# EasyEDA Pro project 高低温转接板_自动化测试平台.eprj

# Schematic Schematic1

## Sheets
1 模拟开关
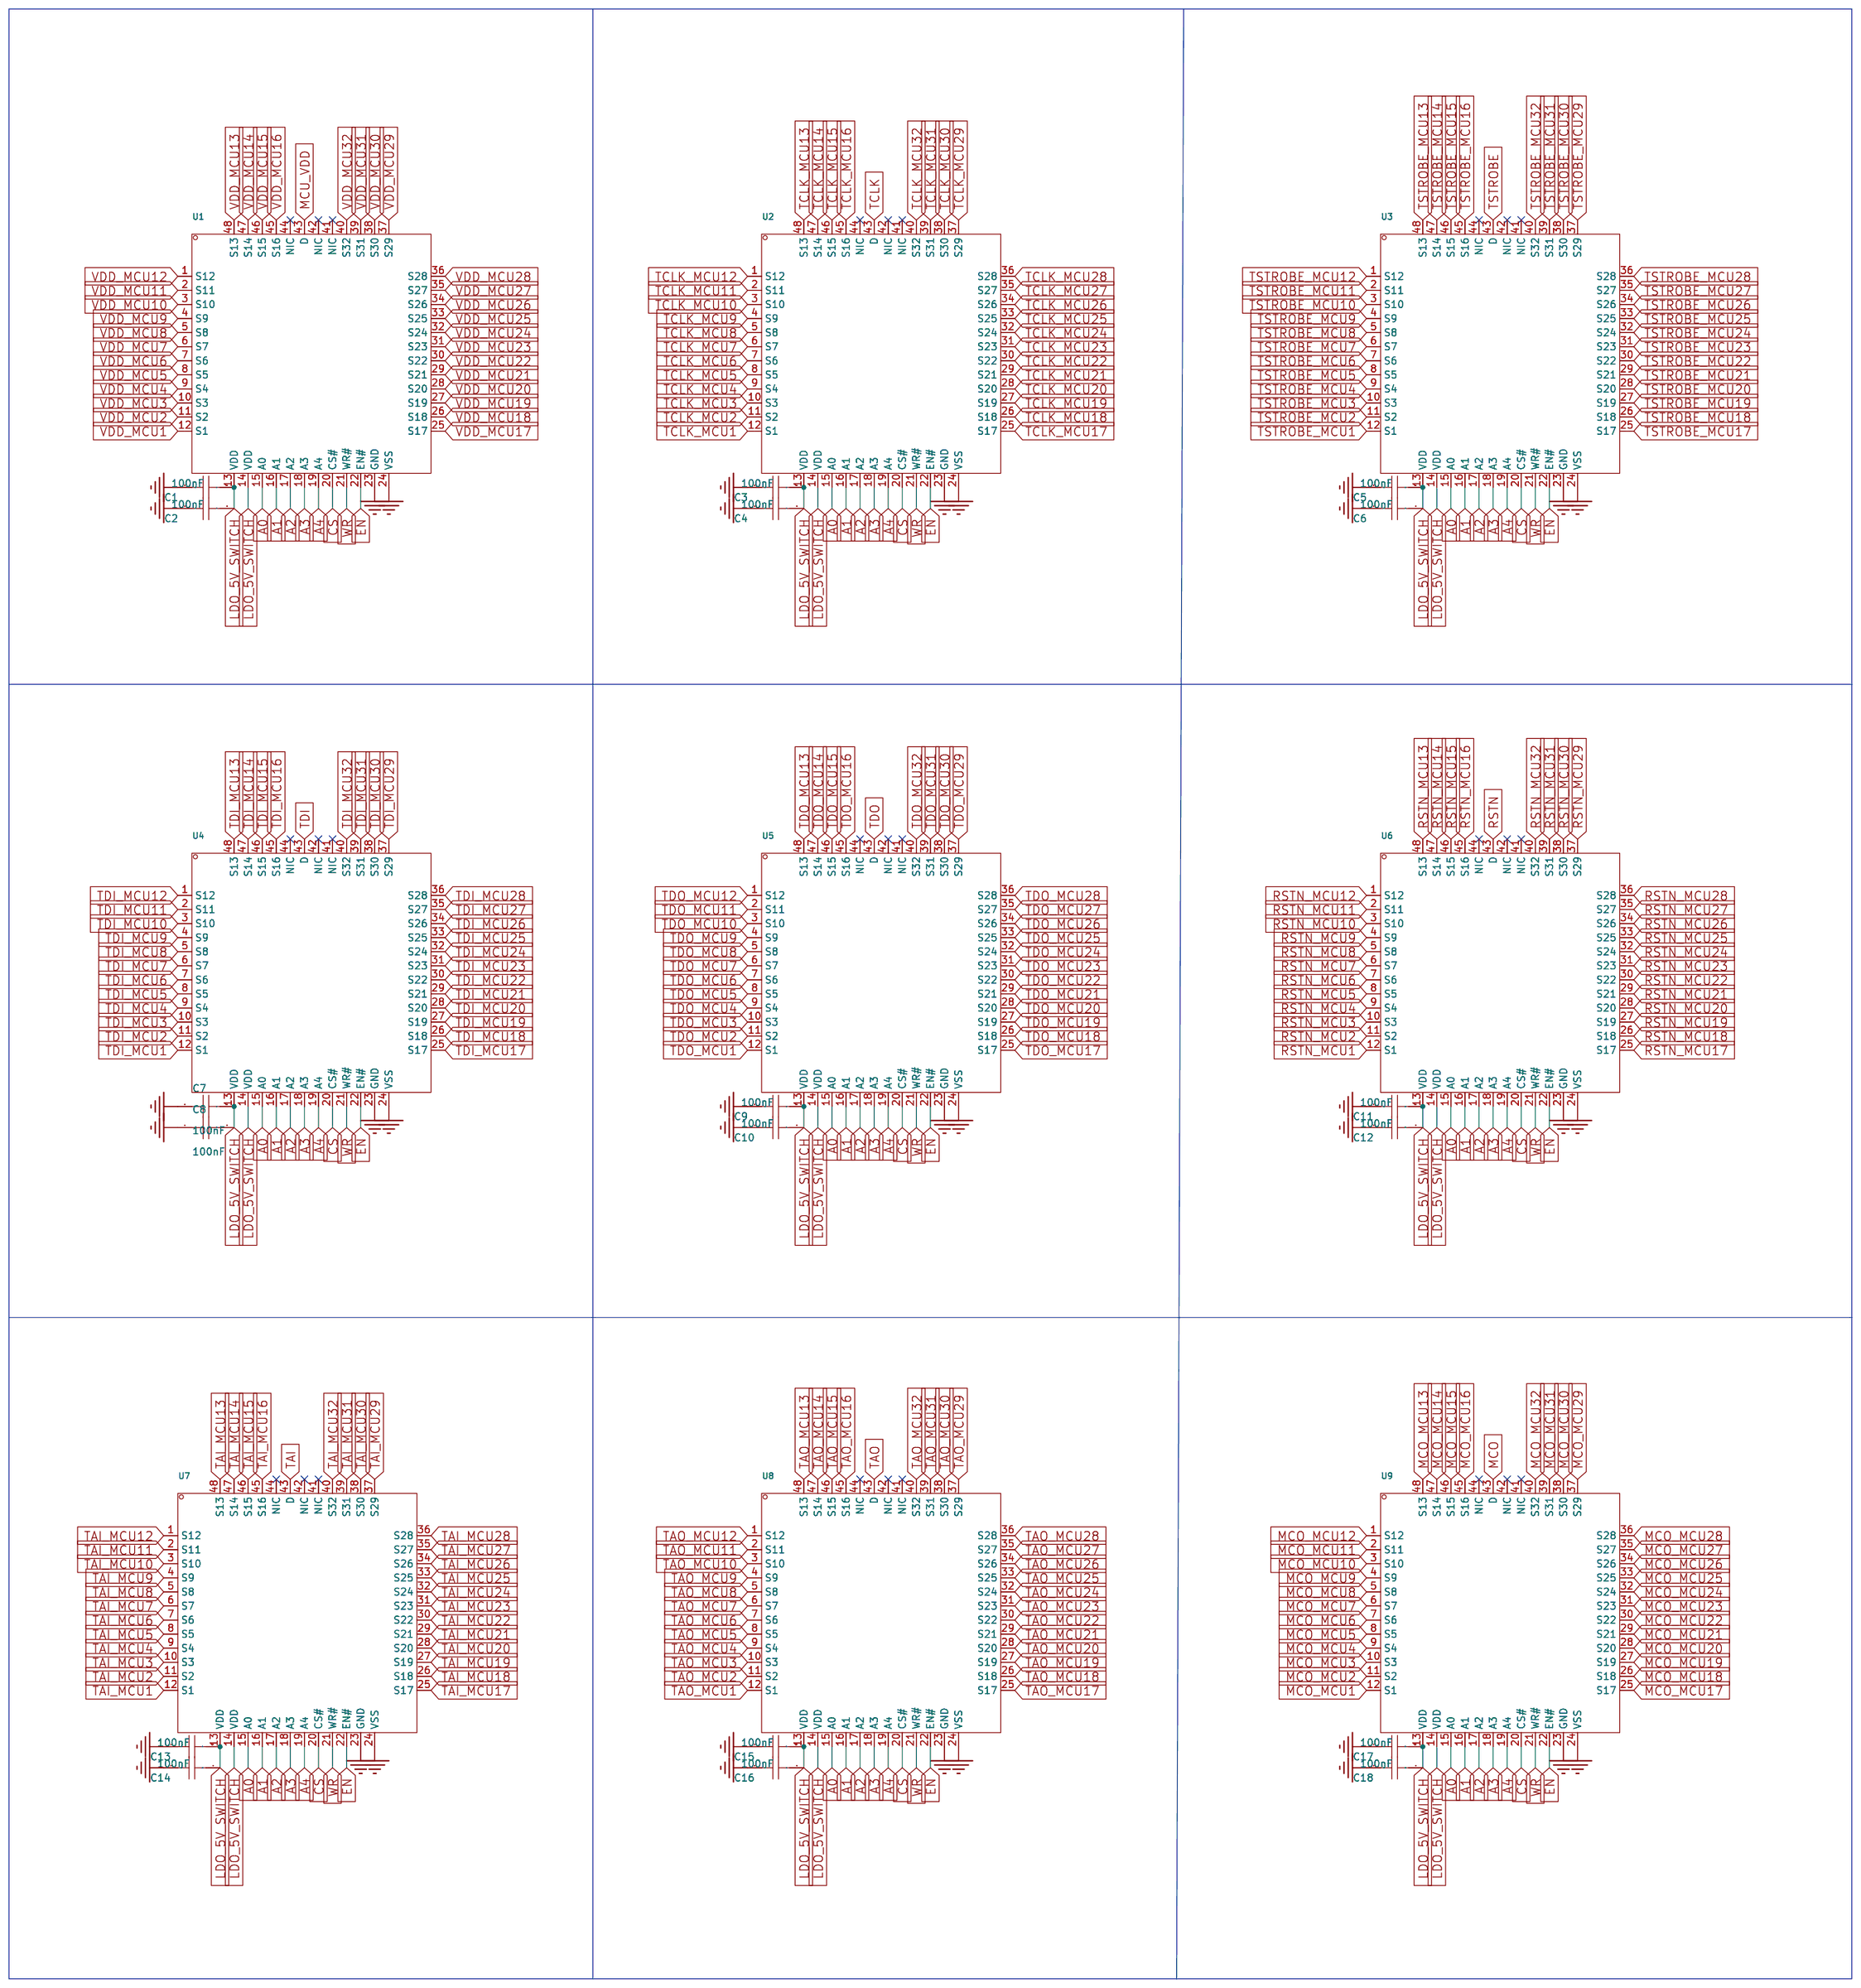
[diagram p0: 模拟开关]
2 485
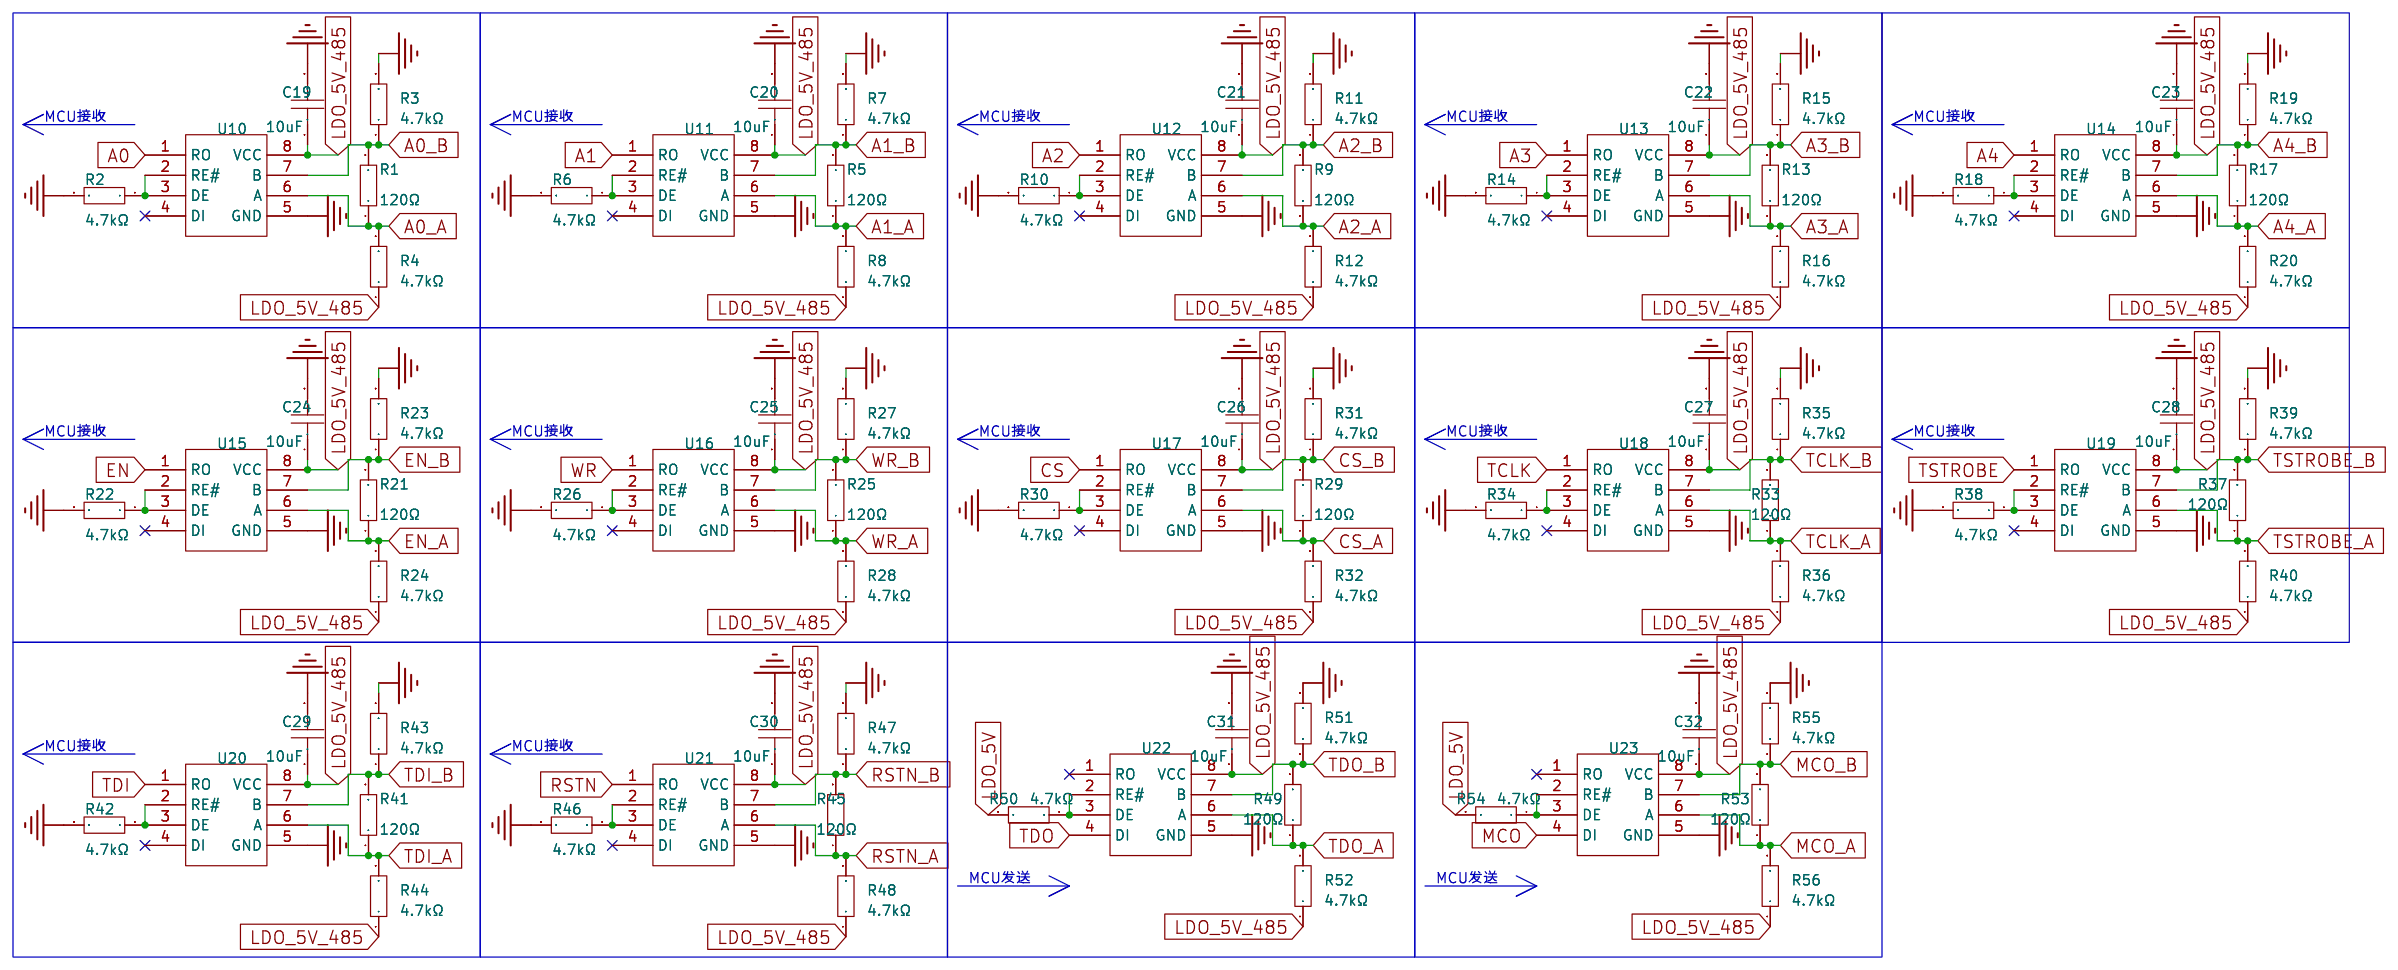
[diagram p1: 485]
3 NI接口
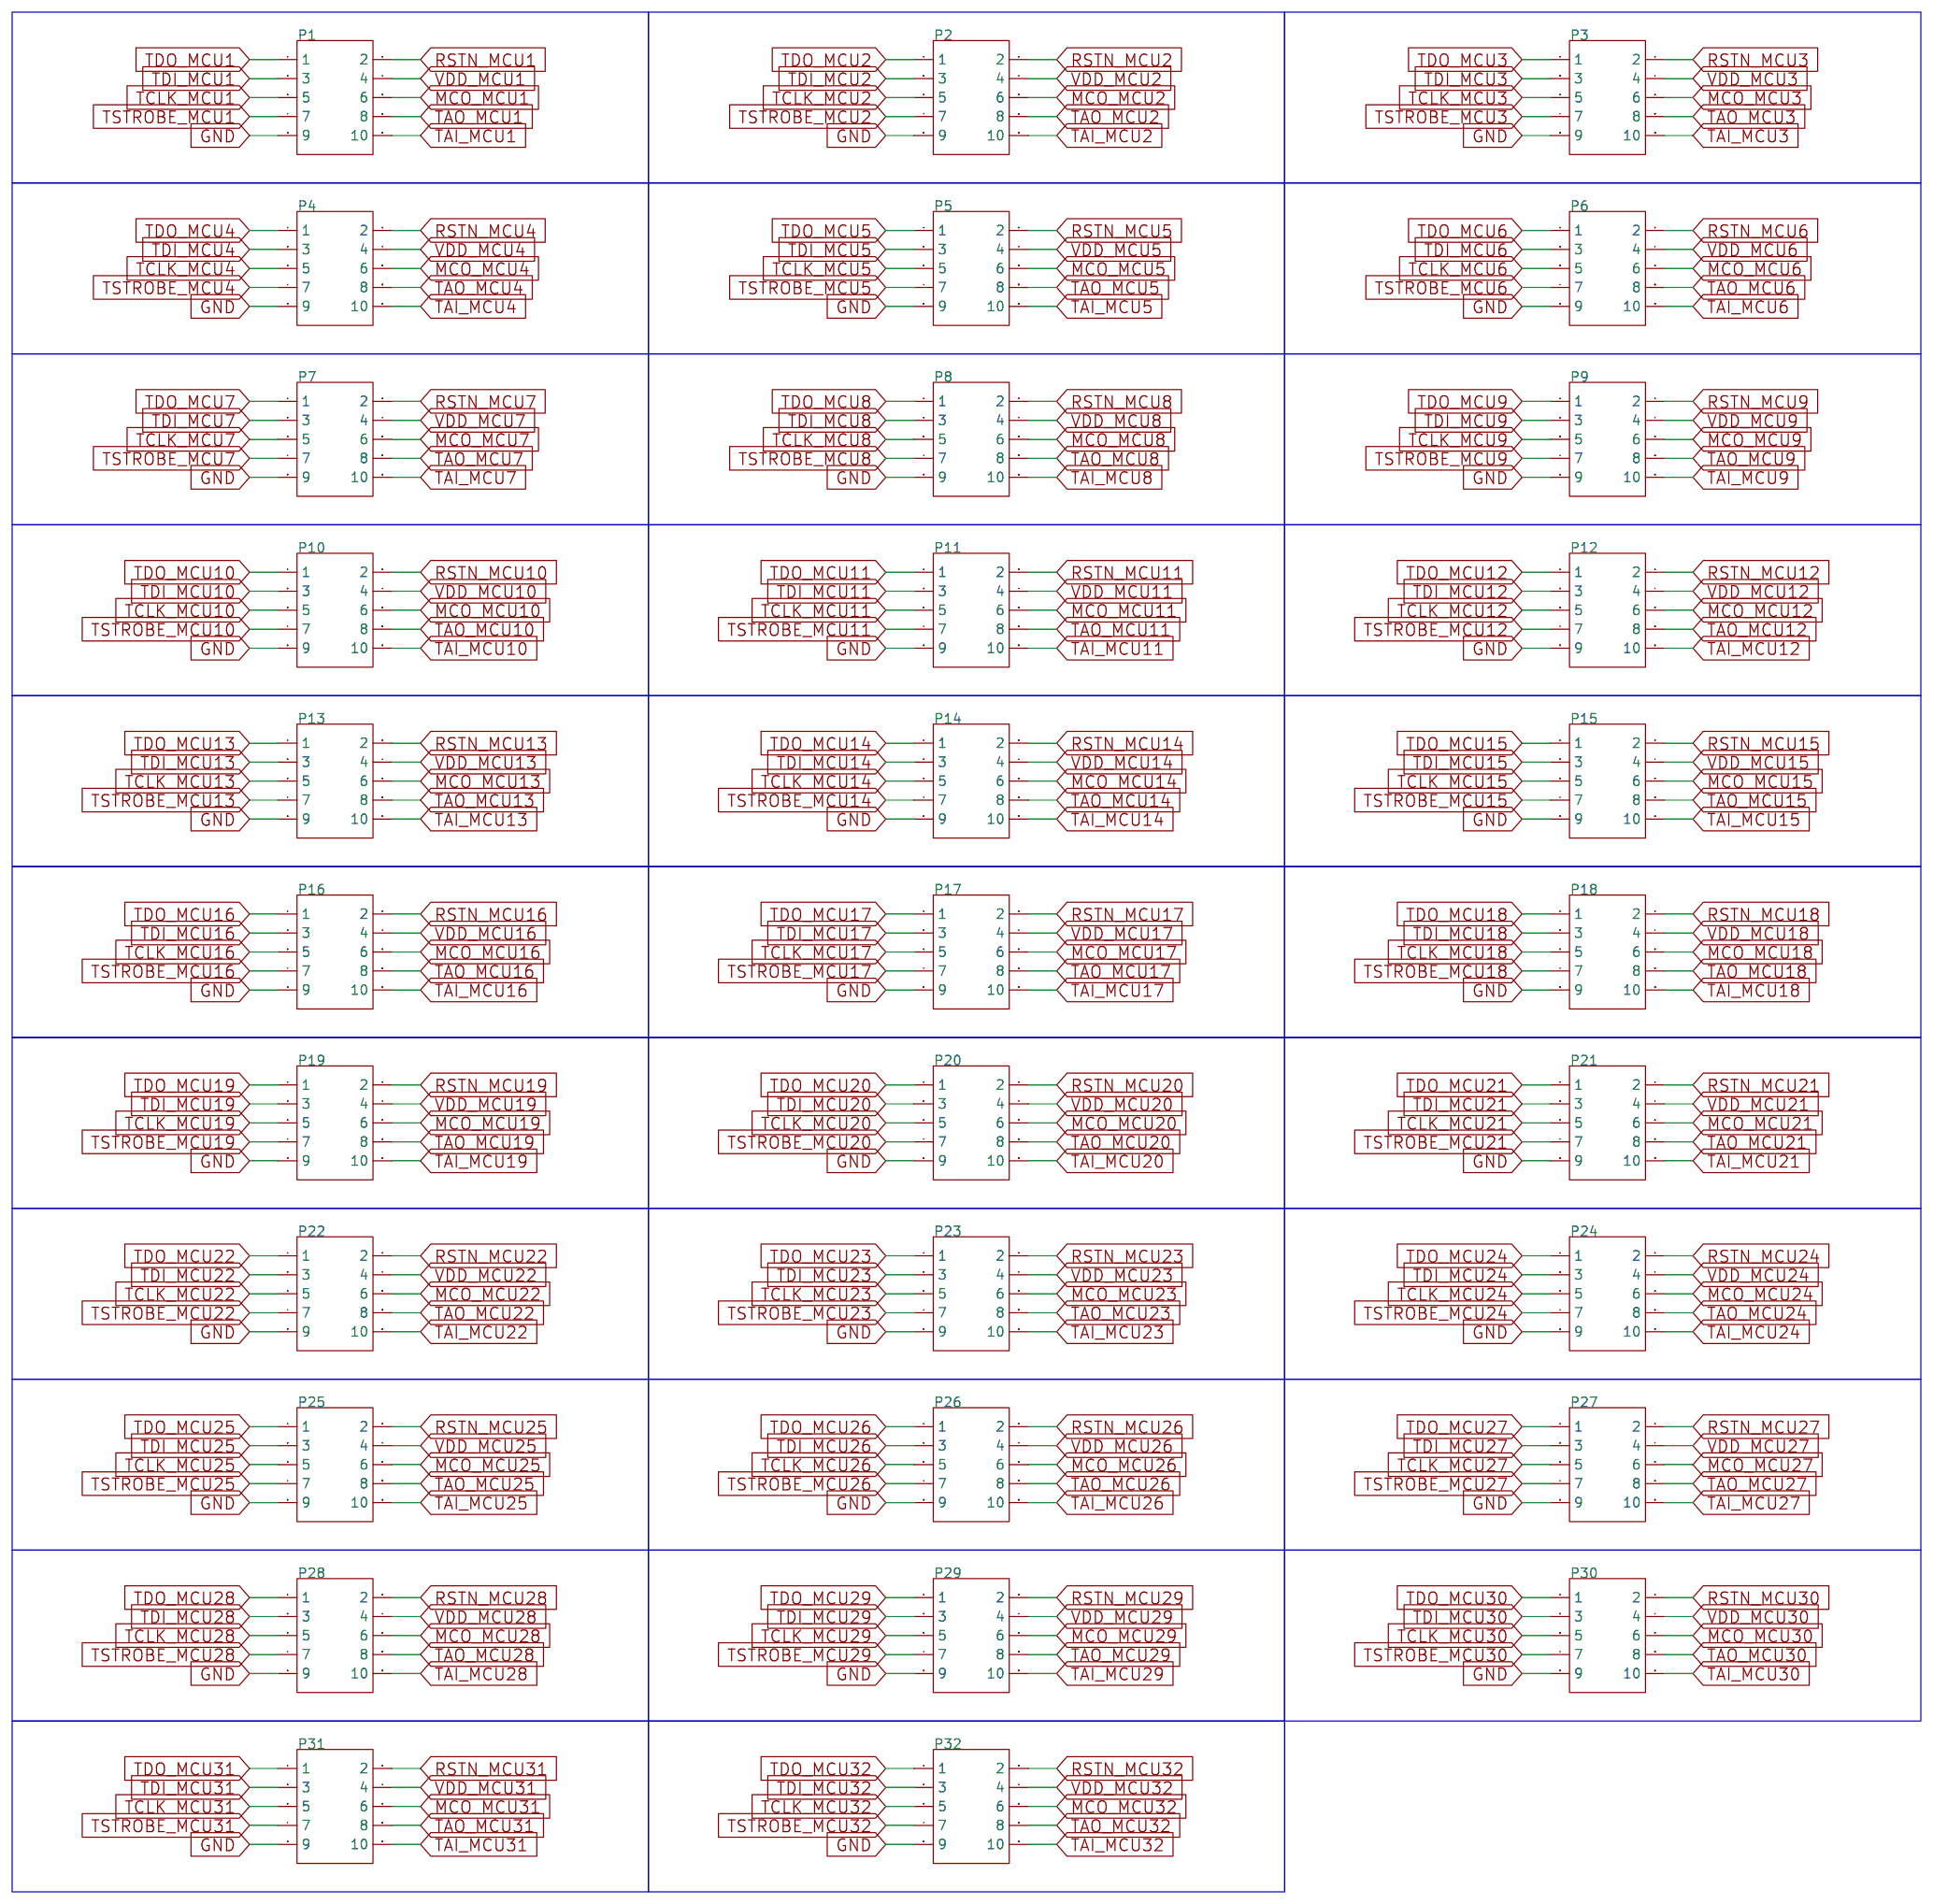
[diagram p2: NI接口]
4 LDO与接线座子
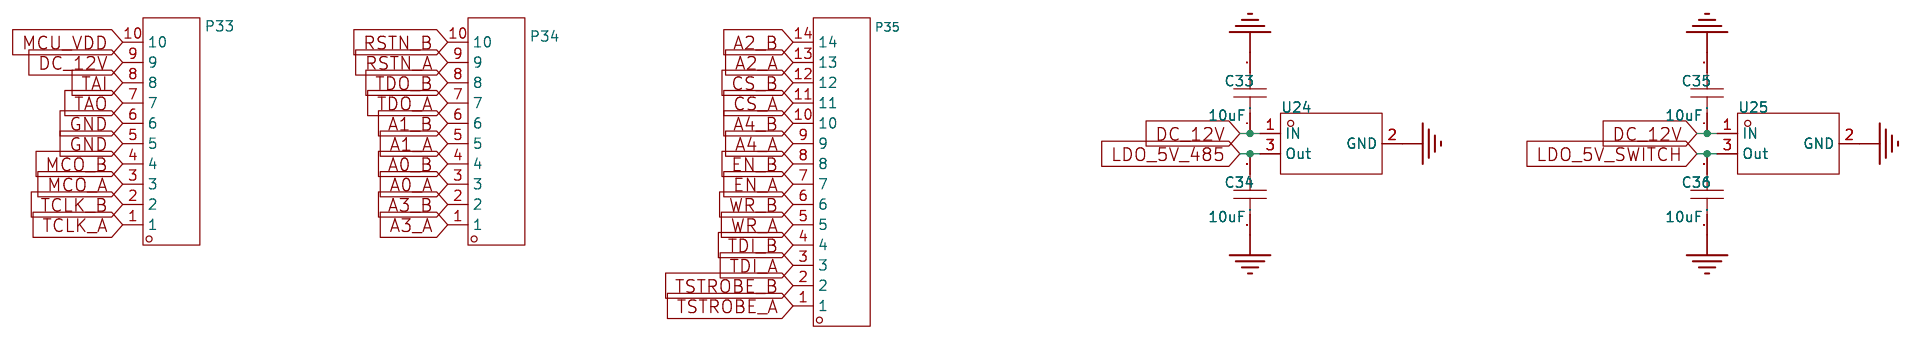
[diagram p3: LDO与接线座子]
5 支撑板子的过孔
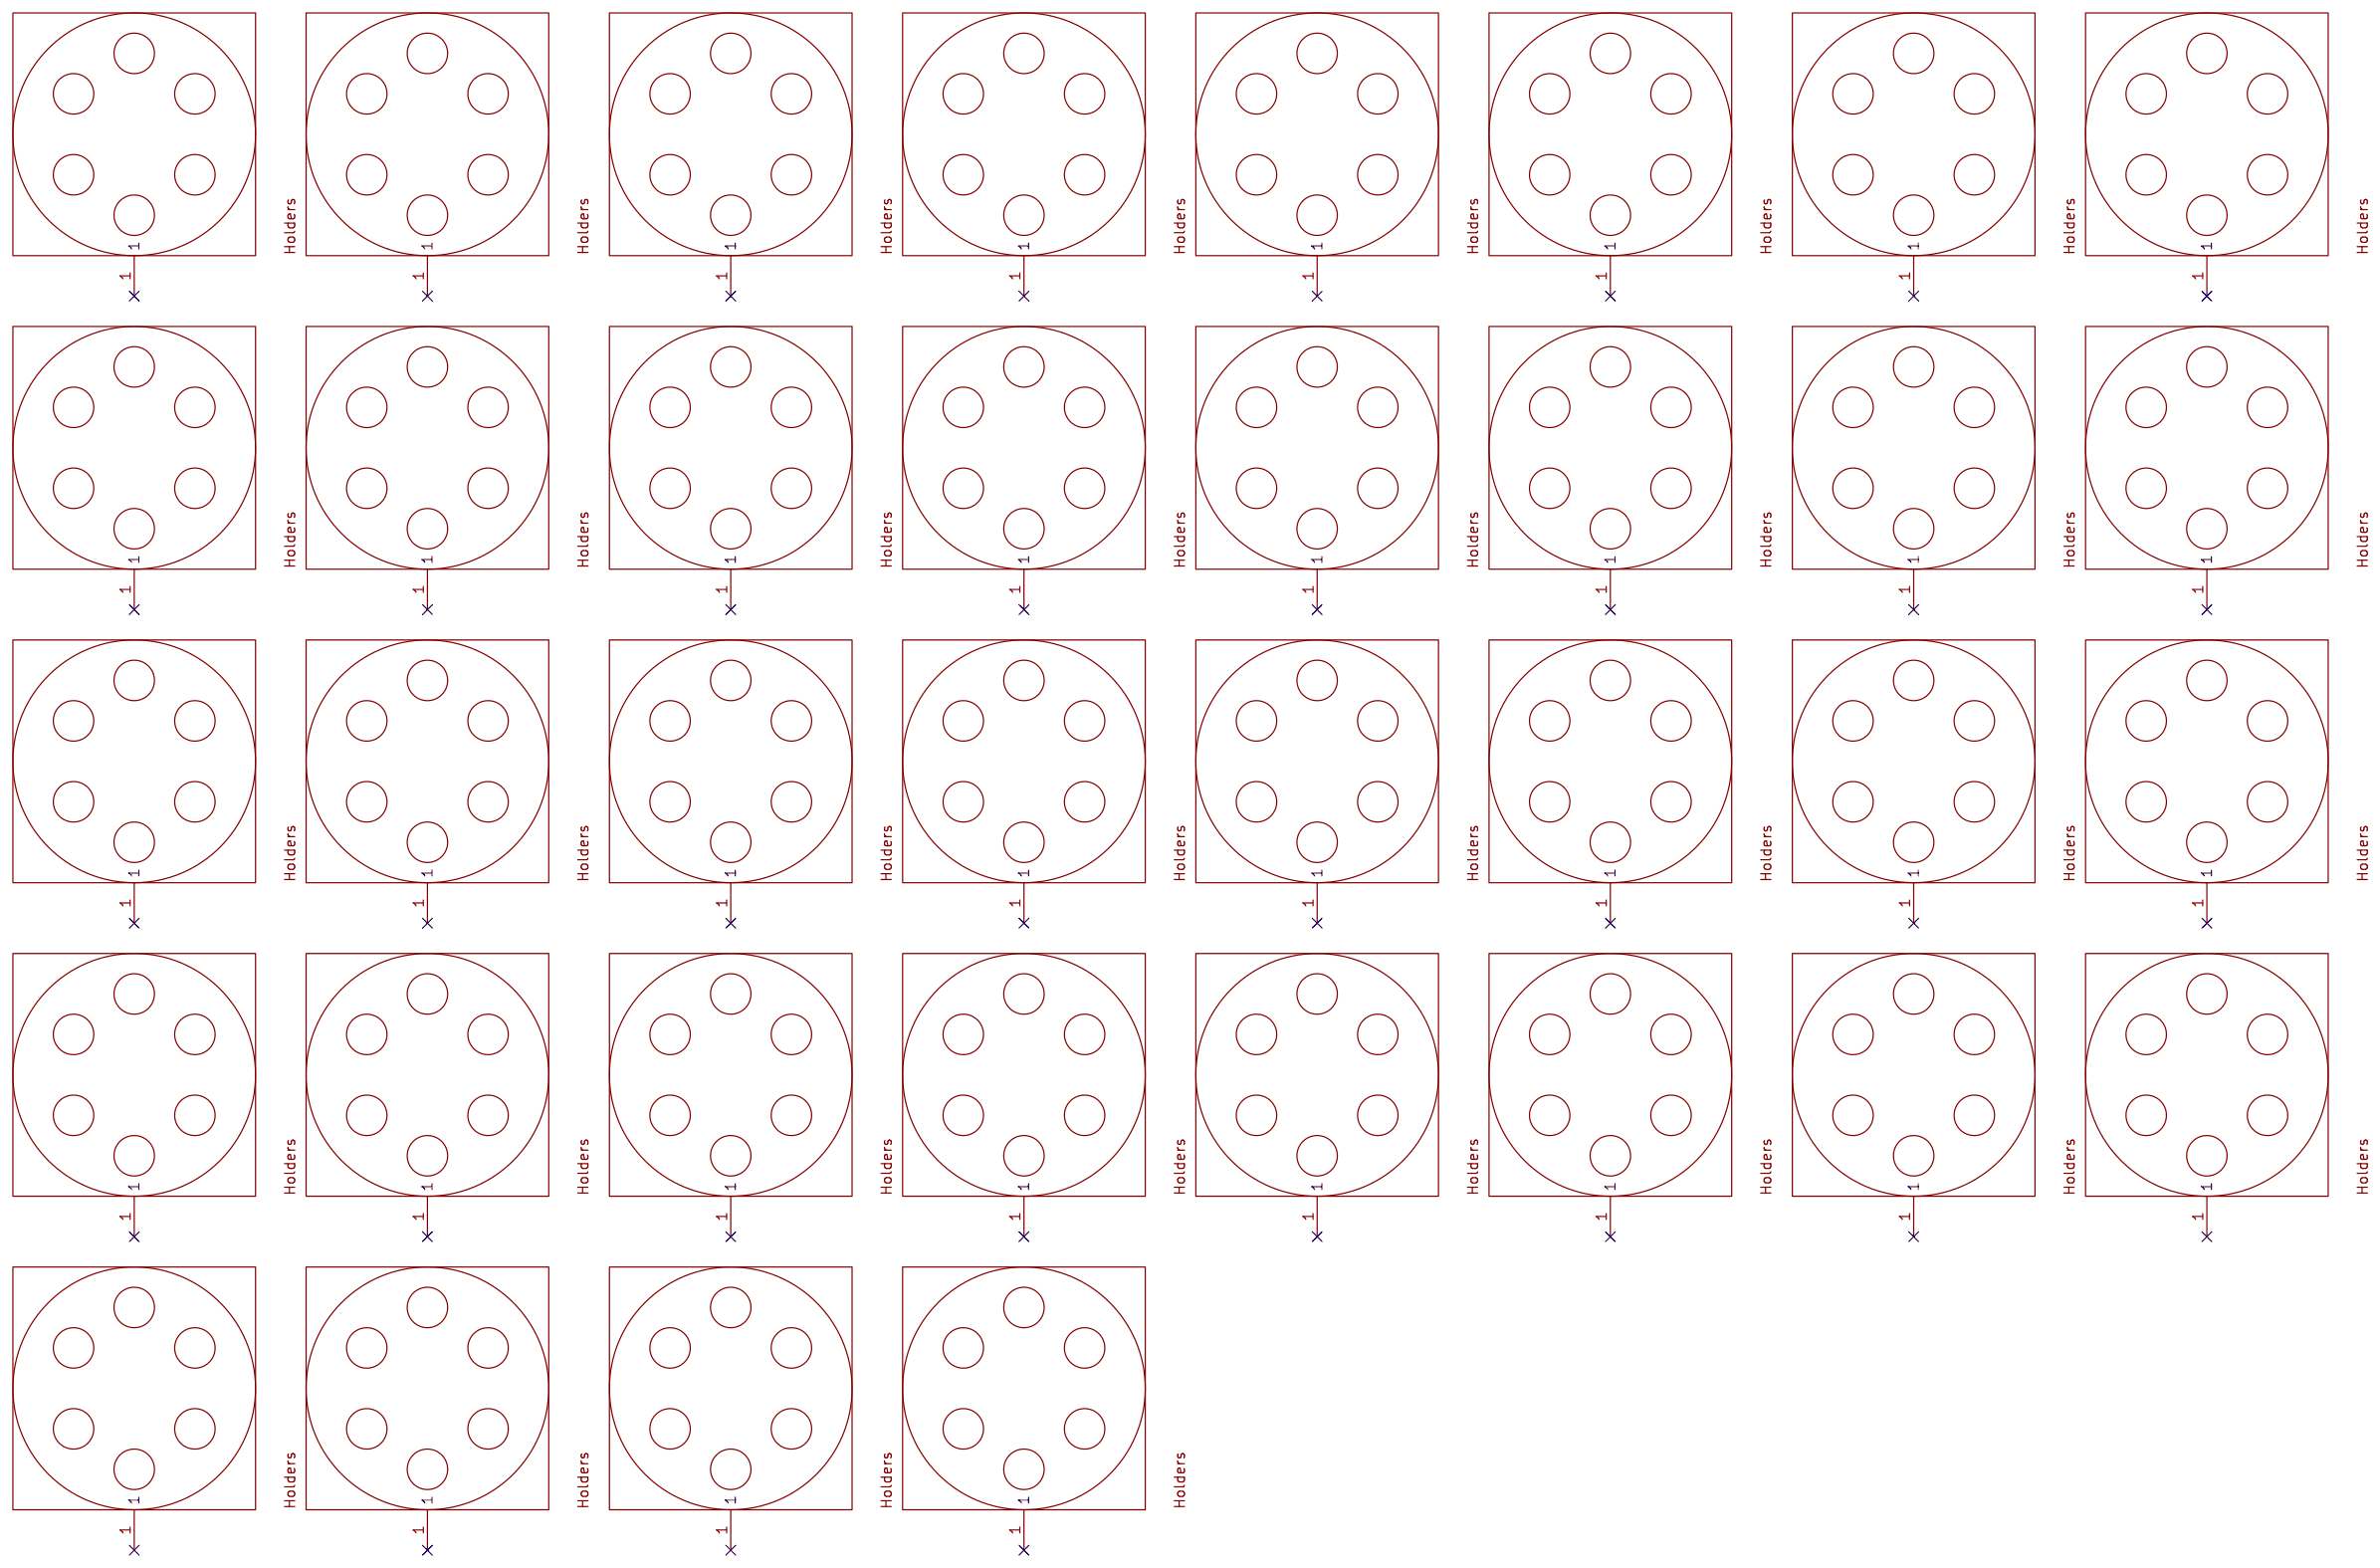
[diagram p4: 支撑板子的过孔]

## Parts
sheet 485
C19  10uF  [C0603]
C20  10uF  [C0603]
C21  10uF  [C0603]
C22  10uF  [C0603]
C23  10uF  [C0603]
C24  10uF  [C0603]
C25  10uF  [C0603]
C26  10uF  [C0603]
C27  10uF  [C0603]
C28  10uF  [C0603]
C29  10uF  [C0603]
C30  10uF  [C0603]
C31  10uF  [C0603]
C32  10uF  [C0603]
R1  120Ω  [R0603]
R2  4.7kΩ  [R0603]
R3  4.7kΩ  [R0603]
R4  4.7kΩ  [R0603]
R5  120Ω  [R0603]
R6  4.7kΩ  [R0603]
R7  4.7kΩ  [R0603]
R8  4.7kΩ  [R0603]
R9  120Ω  [R0603]
R10  4.7kΩ  [R0603]
R11  4.7kΩ  [R0603]
R12  4.7kΩ  [R0603]
R13  120Ω  [R0603]
R14  4.7kΩ  [R0603]
R15  4.7kΩ  [R0603]
R16  4.7kΩ  [R0603]
R17  120Ω  [R0603]
R18  4.7kΩ  [R0603]
R19  4.7kΩ  [R0603]
R20  4.7kΩ  [R0603]
R21  120Ω  [R0603]
R22  4.7kΩ  [R0603]
R23  4.7kΩ  [R0603]
R24  4.7kΩ  [R0603]
R25  120Ω  [R0603]
R26  4.7kΩ  [R0603]
R27  4.7kΩ  [R0603]
R28  4.7kΩ  [R0603]
R29  120Ω  [R0603]
R30  4.7kΩ  [R0603]
R31  4.7kΩ  [R0603]
R32  4.7kΩ  [R0603]
R33  120Ω  [R0603]
R34  4.7kΩ  [R0603]
R35  4.7kΩ  [R0603]
R36  4.7kΩ  [R0603]
R37  120Ω  [R0603]
R38  4.7kΩ  [R0603]
R39  4.7kΩ  [R0603]
R40  4.7kΩ  [R0603]
R41  120Ω  [R0603]
R42  4.7kΩ  [R0603]
R43  4.7kΩ  [R0603]
R44  4.7kΩ  [R0603]
R45  120Ω  [R0603]
R46  4.7kΩ  [R0603]
R47  4.7kΩ  [R0603]
R48  4.7kΩ  [R0603]
R49  120Ω  [R0603]
R50  4.7kΩ  [R0603]
R51  4.7kΩ  [R0603]
R52  4.7kΩ  [R0603]
R53  120Ω  [R0603]
R54  4.7kΩ  [R0603]
R55  4.7kΩ  [R0603]
R56  4.7kΩ  [R0603]
U10  SP485EEN-L/TR  [SOIC-8_L5.0-W4.0-P1.27-LS6.0-BL]
U11  SP485EEN-L/TR  [SOIC-8_L5.0-W4.0-P1.27-LS6.0-BL]
U12  SP485EEN-L/TR  [SOIC-8_L5.0-W4.0-P1.27-LS6.0-BL]
U13  SP485EEN-L/TR  [SOIC-8_L5.0-W4.0-P1.27-LS6.0-BL]
U14  SP485EEN-L/TR  [SOIC-8_L5.0-W4.0-P1.27-LS6.0-BL]
U15  SP485EEN-L/TR  [SOIC-8_L5.0-W4.0-P1.27-LS6.0-BL]
U16  SP485EEN-L/TR  [SOIC-8_L5.0-W4.0-P1.27-LS6.0-BL]
U17  SP485EEN-L/TR  [SOIC-8_L5.0-W4.0-P1.27-LS6.0-BL]
U18  SP485EEN-L/TR  [SOIC-8_L5.0-W4.0-P1.27-LS6.0-BL]
U19  SP485EEN-L/TR  [SOIC-8_L5.0-W4.0-P1.27-LS6.0-BL]
U20  SP485EEN-L/TR  [SOIC-8_L5.0-W4.0-P1.27-LS6.0-BL]
U21  SP485EEN-L/TR  [SOIC-8_L5.0-W4.0-P1.27-LS6.0-BL]
U22  SP485EEN-L/TR  [SOIC-8_L5.0-W4.0-P1.27-LS6.0-BL]
U23  SP485EEN-L/TR  [SOIC-8_L5.0-W4.0-P1.27-LS6.0-BL]
sheet LDO与接线座子
C33  10uF  [C0603]
C34  10uF  [C0603]
C35  10uF  [C0603]
C36  10uF  [C0603]
P33  WJ15EDGRC-3.81-10P  [CONN-TH_10P-P3.81_WJ15EDGRC-3.81-10P]
P34  WJ15EDGRC-3.81-10P  [CONN-TH_10P-P3.81_WJ15EDGRC-3.81-10P]
P35  WJ15EDGRC-3.81-14P  [CONN-TH_14P-P3.81_WJ15EDGRC-3.81-14P]
U24  CJ7805 3%  [TO-252-2_L6.6-W6.1-P4.58-LS10.1-BR-CW]
U25  CJ7805 3%  [TO-252-2_L6.6-W6.1-P4.58-LS10.1-BR-CW]
sheet NI接口
P1  2.54-2*5P简牛  [IDC-TH_10P-P2.54_C5665]
P2  2.54-2*5P简牛  [IDC-TH_10P-P2.54_C5665]
P3  2.54-2*5P简牛  [IDC-TH_10P-P2.54_C5665]
P4  2.54-2*5P简牛  [IDC-TH_10P-P2.54_C5665]
P5  2.54-2*5P简牛  [IDC-TH_10P-P2.54_C5665]
P6  2.54-2*5P简牛  [IDC-TH_10P-P2.54_C5665]
P7  2.54-2*5P简牛  [IDC-TH_10P-P2.54_C5665]
P8  2.54-2*5P简牛  [IDC-TH_10P-P2.54_C5665]
P9  2.54-2*5P简牛  [IDC-TH_10P-P2.54_C5665]
P10  2.54-2*5P简牛  [IDC-TH_10P-P2.54_C5665]
P11  2.54-2*5P简牛  [IDC-TH_10P-P2.54_C5665]
P12  2.54-2*5P简牛  [IDC-TH_10P-P2.54_C5665]
P13  2.54-2*5P简牛  [IDC-TH_10P-P2.54_C5665]
P14  2.54-2*5P简牛  [IDC-TH_10P-P2.54_C5665]
P15  2.54-2*5P简牛  [IDC-TH_10P-P2.54_C5665]
P16  2.54-2*5P简牛  [IDC-TH_10P-P2.54_C5665]
P17  2.54-2*5P简牛  [IDC-TH_10P-P2.54_C5665]
P18  2.54-2*5P简牛  [IDC-TH_10P-P2.54_C5665]
P19  2.54-2*5P简牛  [IDC-TH_10P-P2.54_C5665]
P20  2.54-2*5P简牛  [IDC-TH_10P-P2.54_C5665]
P21  2.54-2*5P简牛  [IDC-TH_10P-P2.54_C5665]
P22  2.54-2*5P简牛  [IDC-TH_10P-P2.54_C5665]
P23  2.54-2*5P简牛  [IDC-TH_10P-P2.54_C5665]
P24  2.54-2*5P简牛  [IDC-TH_10P-P2.54_C5665]
P25  2.54-2*5P简牛  [IDC-TH_10P-P2.54_C5665]
P26  2.54-2*5P简牛  [IDC-TH_10P-P2.54_C5665]
P27  2.54-2*5P简牛  [IDC-TH_10P-P2.54_C5665]
P28  2.54-2*5P简牛  [IDC-TH_10P-P2.54_C5665]
P29  2.54-2*5P简牛  [IDC-TH_10P-P2.54_C5665]
P30  2.54-2*5P简牛  [IDC-TH_10P-P2.54_C5665]
P31  2.54-2*5P简牛  [IDC-TH_10P-P2.54_C5665]
P32  2.54-2*5P简牛  [IDC-TH_10P-P2.54_C5665]
sheet 支撑板子的过孔
J1  -  [DEMO板安装孔]
J2  -  [DEMO板安装孔]
J3  -  [DEMO板安装孔]
J4  -  [DEMO板安装孔]
J5  -  [DEMO板安装孔]
J6  -  [DEMO板安装孔]
J7  -  [DEMO板安装孔]
J8  -  [DEMO板安装孔]
J9  -  [DEMO板安装孔]
J10  -  [DEMO板安装孔]
J11  -  [DEMO板安装孔]
J12  -  [DEMO板安装孔]
J13  -  [DEMO板安装孔]
J14  -  [DEMO板安装孔]
J15  -  [DEMO板安装孔]
J16  -  [DEMO板安装孔]
J17  -  [DEMO板安装孔]
J18  -  [DEMO板安装孔]
J19  -  [DEMO板安装孔]
J20  -  [DEMO板安装孔]
J21  -  [DEMO板安装孔]
J22  -  [DEMO板安装孔]
J23  -  [DEMO板安装孔]
J24  -  [DEMO板安装孔]
J25  -  [DEMO板安装孔]
J26  -  [DEMO板安装孔]
J27  -  [DEMO板安装孔]
J28  -  [DEMO板安装孔]
J29  -  [DEMO板安装孔]
J30  -  [DEMO板安装孔]
J31  -  [DEMO板安装孔]
J32  -  [DEMO板安装孔]
J33  -  [DEMO板安装孔]
J34  -  [DEMO板安装孔]
J35  -  [DEMO板安装孔]
J36  -  [DEMO板安装孔]
sheet 模拟开关
C1  100nF  [C0603]
C2  100nF  [C0603]
C3  100nF  [C0603]
C4  100nF  [C0603]
C5  100nF  [C0603]
C6  100nF  [C0603]
C7  100nF  [C0603]
C8  100nF  [C0603]
C9  100nF  [C0603]
C10  100nF  [C0603]
C11  100nF  [C0603]
C12  100nF  [C0603]
C13  100nF  [C0603]
C14  100nF  [C0603]
C15  100nF  [C0603]
C16  100nF  [C0603]
C17  100nF  [C0603]
C18  100nF  [C0603]
U1  ADG732BSUZ-REEL  [TQFP-48_L7.0-W7.0-P0.50-LS9.0-TL]
U2  ADG732BSUZ-REEL  [TQFP-48_L7.0-W7.0-P0.50-LS9.0-TL]
U3  ADG732BSUZ-REEL  [TQFP-48_L7.0-W7.0-P0.50-LS9.0-TL]
U4  ADG732BSUZ-REEL  [TQFP-48_L7.0-W7.0-P0.50-LS9.0-TL]
U5  ADG732BSUZ-REEL  [TQFP-48_L7.0-W7.0-P0.50-LS9.0-TL]
U6  ADG732BSUZ-REEL  [TQFP-48_L7.0-W7.0-P0.50-LS9.0-TL]
U7  ADG732BSUZ-REEL  [TQFP-48_L7.0-W7.0-P0.50-LS9.0-TL]
U8  ADG732BSUZ-REEL  [TQFP-48_L7.0-W7.0-P0.50-LS9.0-TL]
U9  ADG732BSUZ-REEL  [TQFP-48_L7.0-W7.0-P0.50-LS9.0-TL]

## Library data of the parts
C19-C36 = CL10A106KP8NNNC: 容值:10uF;精度:±10%;额定电压:10V;材质(温度系数):X5R;; LCSC Part Name: 10uF ±10% 10V; Supplier Part: C19702; Manufacturer: SAMSUNG(三星); Supplier Footprint: 0603; JLCPCB Part Class: Basic Part; Datasheet: https://atta.szlcsc.com/upload/public/pdf/source/20160103/1457707703378.pdf; Supplier: LCSC; Tolerance: ±10%; Voltage Rated: 10V; Temperature Coefficient: X5R
R1 R5 R9 R13 R17 R21 R25 R29 R33 R37 R41 R45 R49 R53 = 0603WAF1200T5E: 电阻类型:厚膜电阻;阻值:120Ω;精度:±1%;功率:100mW;; LCSC Part Name: 120Ω ±1% 100mW; Supplier Part: C22787; Manufacturer: UNI-ROYAL(厚声); Supplier Footprint: 0603; JLCPCB Part Class: Basic Part; Datasheet: https://atta.szlcsc.com/upload/public/pdf/source/20200306/C422600_1E6D84923E4A46A82E41ADD87F860B5C.pdf; Supplier: LCSC; Type: 厚膜电阻; Tolerance: ±1%; Power(Watts): 100mW; Temperature Coefficient: ±100ppm/℃; Overload Voltage (Max): 75V; Operating Temperature Range: -55℃~+155℃
R2-R4 R6-R8 R10-R12 R14-R16 R18-R20 R22-R24 R26-R28 R30-R32 R34-R36 R38-R40 R42-R44 R46-R48 R50-R52 R54-R56 = 0603WAF4701T5E: 电阻类型:厚膜电阻;阻值:4.7kΩ;精度:±1%;功率:100mW;; LCSC Part Name: 4.7kΩ ±1% 100mW; Supplier Part: C23162; Manufacturer: UNI-ROYAL(厚声); Supplier Footprint: 0603; JLCPCB Part Class: Basic Part; Datasheet: https://atta.szlcsc.com/upload/public/pdf/source/20200306/C422600_1E6D84923E4A46A82E41ADD87F860B5C.pdf; Supplier: LCSC; Type: 厚膜电阻; Tolerance: ±1%; Power(Watts): 100mW; Temperature Coefficient: ±100ppm/℃; Overload Voltage (Max): 75V; Operating Temperature Range: -55℃~+155℃
U10-U23 = SP485EEN-L/TR: 类型:收发器;驱动器/接收器:1/1;数据速率:10Mbps;; LCSC Part Name: 5V供电 10Mbps 收发器; Supplier Part: C6855; Manufacturer: MaxLinear; Supplier Footprint: SOIC-8; JLCPCB Part Class: Basic Part; Datasheet: https://atta.szlcsc.com/upload/public/pdf/source/20210125/C916163_66C97B5ACCC910994E8B10780F9BD300.pdf; Supplier: LCSC; Types: 收发器; Driver/receiver: 1/1; Data Rate: 10Mbps; Supply Voltage: 4.75V~5.25V
P33 P34 = WJ15EDGRC-3.81-10P: 连接器类型:板端/插座-闭口;间距:3.81mm;排数:1;每排PIN数:10;安装方式:弯针;颜色:绿色;; LCSC Part Name: 板端/插座-闭口 3.81mm 排数:1 每排P数:10 弯针; Supplier Part: C26895; Manufacturer: KANGNEX(康奈克斯电气); Supplier Footprint: P=3.81mm; JLCPCB Part Class: Extended Part; Datasheet: https://atta.szlcsc.com/upload/public/pdf/source/20191225/C26895_4D916DB43CEF69A0001F97FDF773E4BF.pdf; Supplier: LCSC; Connector Type: 板端/插座-闭口; Pitch: 3.81mm; Number of Rows: 1; Number of PINs Per Row: 10; Mounting Style: 弯针; Color: 绿色
P35 = WJ15EDGRC-3.81-14P: 连接器类型:板端/插座-闭口;结构:1x14P;间距:3.81mm;排数:1;每排PIN数:14;安装方式:弯针;颜色:绿色;; LCSC Part Name: 板端/插座-闭口 1x14P 3.81mm 排数:1 每排P数:14 弯针; Supplier Part: C31933; Manufacturer: KANGNEX(康奈克斯电气); Supplier Footprint: 弯插,P=3.81mm; JLCPCB Part Class: Extended Part; Datasheet: https://atta.szlcsc.com/upload/public/pdf/source/20191225/C31933_D56DE114D60976BC410F77D80AC71242.pdf; Supplier: LCSC; Connector Type: 板端/插座-闭口; Structure: 1x14P; Pitch: 3.81mm; Number of Rows: 1; Number of PINs Per Row: 14; Mounting Style: 弯针; Color: 绿色
U24 U25 = CJ7805 3%: 输出类型:固定;输出极性:正;最大输入电压:35V;输出电压:5V;输出电流:1.5A;; LCSC Part Name: 3%; Supplier Part: C21706; Manufacturer: CJ(江苏长电/长晶); Supplier Footprint: TO-252-2(DPAK); JLCPCB Part Class: Extended Part; Datasheet: https://atta.szlcsc.com/upload/public/pdf/source/20171106/C21706_15099535628491092916.pdf; Supplier: LCSC; Output Type: 固定; Output Polarity: 正; Number of Outputs: 1; Maximum Input Voltage: 35V; Output Voltage: 5V; Dropout Voltage: 2V@(1A); Output Current: 1.5A
P1-P32 = 2.54-2*5P简牛: 连接器类型:简牛座;每排PIN数:5;排数:2;间距:2.54mm;行距:2.54mm;封装形式:直插;触头材质:-;触头镀层:-;; LCSC Part Name: 每排P数:5 排数:2 2.54mm; Supplier Part: C5665; Manufacturer: BOOMELE(博穆精密); Supplier Footprint: 插件,P=2.54mm; JLCPCB Part Class: Extended Part; Datasheet: https://atta.szlcsc.com/upload/public/pdf/source/20140331/1457707037896.pdf; Supplier: LCSC; Connector Type: 简牛座; Pin Number in each Row: 5; Number of Rows: 2; Pitch: 2.54mm; Row Spacing: 2.54mm; Holder Type: 直插
J1-J36 = 螺孔_3.1X6MM
C1-C18 = CC0603KRX7R9BB104: 容值:100nF;精度:±10%;额定电压:50V;材质(温度系数):X7R;; LCSC Part Name: 100nF ±10% 50V; Supplier Part: C14663; Manufacturer: YAGEO(国巨); Supplier Footprint: 0603; JLCPCB Part Class: Basic Part; Datasheet: https://atta.szlcsc.com/upload/public/pdf/source/20180910/C282072_33301C7F631E79921B82A8DAC6BCC5B3.pdf; Supplier: LCSC; Tolerance: ±10%; Voltage Rated: 50V; Temperature Coefficient: X7R
U1-U9 = ADG732BSUZ-REEL: 开关电路:-;通道数:1;导通电阻(Ron@VCC):5.5Ω;; Supplier Part: C114845; Manufacturer: ADI(亚德诺); Supplier Footprint: TQFP-48(7x7); JLCPCB Part Class: Extended Part; Datasheet: https://atta.szlcsc.com/upload/public/pdf/source/20180704/C114845_D89ABA8A6C0648217DCBF144CEE84129.pdf; Supplier: LCSC; Number of Channels: 1; On-State Resistance (Max): 5.5Ω; Supply Voltage: 1.8V~5.5V

## Nets
GND: C1.1 C2.1 C3.1 C4.1 C5.1 C6.1 C7.1 C8.1 C9.1 C10.1 C11.1 C12.1 C13.1 C14.1 C15.1 C16.1 C17.1 C18.1 C19.2 C20.2 C21.2 C22.2 C23.2 C24.2 C25.2 C26.2 C27.2 C28.2 C29.2 C30.2 C31.2 C32.2 C33.2 C34.1 C35.2 C36.1 P1.9 P2.9 P3.9 P4.9 P5.9 P6.9 P7.9 P8.9 P9.9 P10.9 P11.9 P12.9 P13.9 P14.9 P15.9 P16.9 P17.9 P18.9 P19.9 P20.9 P21.9 P22.9 P23.9 P24.9 P25.9 P26.9 P27.9 P28.9 P29.9 P30.9 P31.9 P32.9 P33.5 P33.6 R2.2 R3.2 R6.2 R7.2 R10.2 R11.2 R14.2 R15.2 R18.2 R19.2 R22.2 R23.2 R26.2 R27.2 R30.2 R31.2 R34.2 R35.2 R38.2 R39.2 R42.2 R43.2 R46.2 R47.2 R51.2 R55.2 U1.23(GND) U1.24(VSS) U2.23(GND) U2.24(VSS) U3.23(GND) U3.24(VSS) U4.23(GND) U4.24(VSS) U5.23(GND) U5.24(VSS) U6.23(GND) U6.24(VSS) U7.23(GND) U7.24(VSS) U8.23(GND) U8.24(VSS) U9.23(GND) U9.24(VSS) U10.5(GND) U11.5(GND) U12.5(GND) U13.5(GND) U14.5(GND) U15.5(GND) U16.5(GND) U17.5(GND) U18.5(GND) U19.5(GND) U20.5(GND) U21.5(GND) U22.5(GND) U23.5(GND) U24.2(GND) U25.2(GND)
VDD_MCU1: P1.4 U1.12(S1)
VDD_MCU2: P2.4 U1.11(S2)
VDD_MCU3: P3.4 U1.10(S3)
VDD_MCU4: P4.4 U1.9(S4)
VDD_MCU5: P5.4 U1.8(S5)
VDD_MCU6: P6.4 U1.7(S6)
VDD_MCU7: P7.4 U1.6(S7)
VDD_MCU8: P8.4 U1.5(S8)
VDD_MCU9: P9.4 U1.4(S9)
VDD_MCU10: P10.4 U1.3(S10)
VDD_MCU11: P11.4 U1.2(S11)
VDD_MCU12: P12.4 U1.1(S12)
VDD_MCU13: P13.4 U1.48(S13)
VDD_MCU14: P14.4 U1.47(S14)
VDD_MCU15: P15.4 U1.46(S15)
VDD_MCU16: P16.4 U1.45(S16)
VDD_MCU17: P17.4 U1.25(S17)
VDD_MCU18: P18.4 U1.26(S18)
VDD_MCU19: P19.4 U1.27(S19)
VDD_MCU20: P20.4 U1.28(S20)
VDD_MCU21: P21.4 U1.29(S21)
VDD_MCU22: P22.4 U1.30(S22)
VDD_MCU23: P23.4 U1.31(S23)
VDD_MCU24: P24.4 U1.32(S24)
VDD_MCU25: P25.4 U1.33(S25)
VDD_MCU26: P26.4 U1.34(S26)
VDD_MCU27: P27.4 U1.35(S27)
VDD_MCU28: P28.4 U1.36(S28)
VDD_MCU29: P29.4 U1.37(S29)
VDD_MCU30: P30.4 U1.38(S30)
VDD_MCU31: P31.4 U1.39(S31)
VDD_MCU32: P32.4 U1.40(S32)
A0: U1.15(A0) U2.15(A0) U3.15(A0) U4.15(A0) U5.15(A0) U6.15(A0) U7.15(A0) U8.15(A0) U9.15(A0) U10.1(RO)
A0_A: P34.3 R1.1 R4.2 U10.6(A)
A0_B: P34.4 R1.2 R3.1 U10.7(B)
A1: U1.16(A1) U2.16(A1) U3.16(A1) U4.16(A1) U5.16(A1) U6.16(A1) U7.16(A1) U8.16(A1) U9.16(A1) U11.1(RO)
A1_A: P34.5 R5.1 R8.2 U11.6(A)
A1_B: P34.6 R5.2 R7.1 U11.7(B)
A2: U1.17(A2) U2.17(A2) U3.17(A2) U4.17(A2) U5.17(A2) U6.17(A2) U7.17(A2) U8.17(A2) U9.17(A2) U12.1(RO)
A2_A: P35.13 R9.1 R12.2 U12.6(A)
A2_B: P35.14 R9.2 R11.1 U12.7(B)
A3: U1.18(A3) U2.18(A3) U3.18(A3) U4.18(A3) U5.18(A3) U6.18(A3) U7.18(A3) U8.18(A3) U9.18(A3) U13.1(RO)
A3_A: P34.1 R13.1 R16.2 U13.6(A)
A3_B: P34.2 R13.2 R15.1 U13.7(B)
A4: U1.19(A4) U2.19(A4) U3.19(A4) U4.19(A4) U5.19(A4) U6.19(A4) U7.19(A4) U8.19(A4) U9.19(A4) U14.1(RO)
A4_A: P35.9 R17.1 R20.2 U14.6(A)
A4_B: P35.10 R17.2 R19.1 U14.7(B)
CS: U1.20(CS#) U2.20(CS#) U3.20(CS#) U4.20(CS#) U5.20(CS#) U6.20(CS#) U7.20(CS#) U8.20(CS#) U9.20(CS#) U17.1(RO)
CS_A: P35.11 R29.1 R32.2 U17.6(A)
CS_B: P35.12 R29.2 R31.1 U17.7(B)
DC_12V: C33.1 C35.1 P33.9 U24.1(IN) U25.1(IN)
EN: U1.22(EN#) U2.22(EN#) U3.22(EN#) U4.22(EN#) U5.22(EN#) U6.22(EN#) U7.22(EN#) U8.22(EN#) U9.22(EN#) U15.1(RO)
EN_A: P35.7 R21.1 R24.2 U15.6(A)
EN_B: P35.8 R21.2 R23.1 U15.7(B)
LDO_5V: R50.2 R54.2
LDO_5V_485: C19.1 C20.1 C21.1 C22.1 C23.1 C24.1 C25.1 C26.1 C27.1 C28.1 C29.1 C30.1 C31.1 C32.1 C34.2 R4.1 R8.1 R12.1 R16.1 R20.1 R24.1 R28.1 R32.1 R36.1 R40.1 R44.1 R48.1 R52.1 R56.1 U10.8(VCC) U11.8(VCC) U12.8(VCC) U13.8(VCC) U14.8(VCC) U15.8(VCC) U16.8(VCC) U17.8(VCC) U18.8(VCC) U19.8(VCC) U20.8(VCC) U21.8(VCC) U22.8(VCC) U23.8(VCC) U24.3(Out)
LDO_5V_SWITCH: C1.2 C2.2 C3.2 C4.2 C5.2 C6.2 C7.2 C8.2 C9.2 C10.2 C11.2 C12.2 C13.2 C14.2 C15.2 C16.2 C17.2 C18.2 C36.2 U1.13(VDD) U1.14(VDD) U2.13(VDD) U2.14(VDD) U3.13(VDD) U3.14(VDD) U4.13(VDD) U4.14(VDD) U5.13(VDD) U5.14(VDD) U6.13(VDD) U6.14(VDD) U7.13(VDD) U7.14(VDD) U8.13(VDD) U8.14(VDD) U9.13(VDD) U9.14(VDD) U25.3(Out)
MCO: U9.43(D) U23.4(DI)
MCO_A: P33.3 R53.1 R56.2 U23.6(A)
MCO_B: P33.4 R53.2 R55.1 U23.7(B)
MCO_MCU1: P1.6 U9.12(S1)
MCO_MCU2: P2.6 U9.11(S2)
MCO_MCU3: P3.6 U9.10(S3)
MCO_MCU4: P4.6 U9.9(S4)
MCO_MCU5: P5.6 U9.8(S5)
MCO_MCU6: P6.6 U9.7(S6)
MCO_MCU7: P7.6 U9.6(S7)
MCO_MCU8: P8.6 U9.5(S8)
MCO_MCU9: P9.6 U9.4(S9)
MCO_MCU10: P10.6 U9.3(S10)
MCO_MCU11: P11.6 U9.2(S11)
MCO_MCU12: P12.6 U9.1(S12)
MCO_MCU13: P13.6 U9.48(S13)
MCO_MCU14: P14.6 U9.47(S14)
MCO_MCU15: P15.6 U9.46(S15)
MCO_MCU16: P16.6 U9.45(S16)
MCO_MCU17: P17.6 U9.25(S17)
MCO_MCU18: P18.6 U9.26(S18)
MCO_MCU19: P19.6 U9.27(S19)
MCO_MCU20: P20.6 U9.28(S20)
MCO_MCU21: P21.6 U9.29(S21)
MCO_MCU22: P22.6 U9.30(S22)
MCO_MCU23: P23.6 U9.31(S23)
MCO_MCU24: P24.6 U9.32(S24)
MCO_MCU25: P25.6 U9.33(S25)
MCO_MCU26: P26.6 U9.34(S26)
MCO_MCU27: P27.6 U9.35(S27)
MCO_MCU28: P28.6 U9.36(S28)
MCO_MCU29: P29.6 U9.37(S29)
MCO_MCU30: P30.6 U9.38(S30)
MCO_MCU31: P31.6 U9.39(S31)
MCO_MCU32: P32.6 U9.40(S32)
MCU_VDD: P33.10 U1.43(D)
RSTN: U6.43(D) U21.1(RO)
RSTN_A: P34.9 R45.1 R48.2 U21.6(A)
RSTN_B: P34.10 R45.2 R47.1 U21.7(B)
RSTN_MCU1: P1.2 U6.12(S1)
RSTN_MCU2: P2.2 U6.11(S2)
RSTN_MCU3: P3.2 U6.10(S3)
RSTN_MCU4: P4.2 U6.9(S4)
RSTN_MCU5: P5.2 U6.8(S5)
RSTN_MCU6: P6.2 U6.7(S6)
RSTN_MCU7: P7.2 U6.6(S7)
RSTN_MCU8: P8.2 U6.5(S8)
RSTN_MCU9: P9.2 U6.4(S9)
RSTN_MCU10: P10.2 U6.3(S10)
RSTN_MCU11: P11.2 U6.2(S11)
RSTN_MCU12: P12.2 U6.1(S12)
RSTN_MCU13: P13.2 U6.48(S13)
RSTN_MCU14: P14.2 U6.47(S14)
RSTN_MCU15: P15.2 U6.46(S15)
RSTN_MCU16: P16.2 U6.45(S16)
RSTN_MCU17: P17.2 U6.25(S17)
RSTN_MCU18: P18.2 U6.26(S18)
RSTN_MCU19: P19.2 U6.27(S19)
RSTN_MCU20: P20.2 U6.28(S20)
RSTN_MCU21: P21.2 U6.29(S21)
RSTN_MCU22: P22.2 U6.30(S22)
RSTN_MCU23: P23.2 U6.31(S23)
RSTN_MCU24: P24.2 U6.32(S24)
RSTN_MCU25: P25.2 U6.33(S25)
RSTN_MCU26: P26.2 U6.34(S26)
RSTN_MCU27: P27.2 U6.35(S27)
RSTN_MCU28: P28.2 U6.36(S28)
RSTN_MCU29: P29.2 U6.37(S29)
RSTN_MCU30: P30.2 U6.38(S30)
RSTN_MCU31: P31.2 U6.39(S31)
RSTN_MCU32: P32.2 U6.40(S32)
TAI: P33.8 U7.43(D)
TAI_MCU1: P1.10 U7.12(S1)
TAI_MCU2: P2.10 U7.11(S2)
TAI_MCU3: P3.10 U7.10(S3)
TAI_MCU4: P4.10 U7.9(S4)
TAI_MCU5: P5.10 U7.8(S5)
TAI_MCU6: P6.10 U7.7(S6)
TAI_MCU7: P7.10 U7.6(S7)
TAI_MCU8: P8.10 U7.5(S8)
TAI_MCU9: P9.10 U7.4(S9)
TAI_MCU10: P10.10 U7.3(S10)
TAI_MCU11: P11.10 U7.2(S11)
TAI_MCU12: P12.10 U7.1(S12)
TAI_MCU13: P13.10 U7.48(S13)
TAI_MCU14: P14.10 U7.47(S14)
TAI_MCU15: P15.10 U7.46(S15)
TAI_MCU16: P16.10 U7.45(S16)
TAI_MCU17: P17.10 U7.25(S17)
TAI_MCU18: P18.10 U7.26(S18)
TAI_MCU19: P19.10 U7.27(S19)
TAI_MCU20: P20.10 U7.28(S20)
TAI_MCU21: P21.10 U7.29(S21)
TAI_MCU22: P22.10 U7.30(S22)
TAI_MCU23: P23.10 U7.31(S23)
TAI_MCU24: P24.10 U7.32(S24)
TAI_MCU25: P25.10 U7.33(S25)
TAI_MCU26: P26.10 U7.34(S26)
TAI_MCU27: P27.10 U7.35(S27)
TAI_MCU28: P28.10 U7.36(S28)
TAI_MCU29: P29.10 U7.37(S29)
TAI_MCU30: P30.10 U7.38(S30)
TAI_MCU31: P31.10 U7.39(S31)
TAI_MCU32: P32.10 U7.40(S32)
TAO: P33.7 U8.43(D)
TAO_MCU1: P1.8 U8.12(S1)
TAO_MCU2: P2.8 U8.11(S2)
TAO_MCU3: P3.8 U8.10(S3)
TAO_MCU4: P4.8 U8.9(S4)
TAO_MCU5: P5.8 U8.8(S5)
TAO_MCU6: P6.8 U8.7(S6)
TAO_MCU7: P7.8 U8.6(S7)
TAO_MCU8: P8.8 U8.5(S8)
TAO_MCU9: P9.8 U8.4(S9)
TAO_MCU10: P10.8 U8.3(S10)
TAO_MCU11: P11.8 U8.2(S11)
TAO_MCU12: P12.8 U8.1(S12)
TAO_MCU13: P13.8 U8.48(S13)
TAO_MCU14: P14.8 U8.47(S14)
TAO_MCU15: P15.8 U8.46(S15)
TAO_MCU16: P16.8 U8.45(S16)
TAO_MCU17: P17.8 U8.25(S17)
TAO_MCU18: P18.8 U8.26(S18)
TAO_MCU19: P19.8 U8.27(S19)
TAO_MCU20: P20.8 U8.28(S20)
TAO_MCU21: P21.8 U8.29(S21)
TAO_MCU22: P22.8 U8.30(S22)
TAO_MCU23: P23.8 U8.31(S23)
TAO_MCU24: P24.8 U8.32(S24)
TAO_MCU25: P25.8 U8.33(S25)
TAO_MCU26: P26.8 U8.34(S26)
TAO_MCU27: P27.8 U8.35(S27)
TAO_MCU28: P28.8 U8.36(S28)
TAO_MCU29: P29.8 U8.37(S29)
TAO_MCU30: P30.8 U8.38(S30)
TAO_MCU31: P31.8 U8.39(S31)
TAO_MCU32: P32.8 U8.40(S32)
TCLK: U2.43(D) U18.1(RO)
TCLK_A: P33.1 R33.1 R36.2 U18.6(A)
TCLK_B: P33.2 R33.2 R35.1 U18.7(B)
TCLK_MCU1: P1.5 U2.12(S1)
TCLK_MCU2: P2.5 U2.11(S2)
TCLK_MCU3: P3.5 U2.10(S3)
TCLK_MCU4: P4.5 U2.9(S4)
TCLK_MCU5: P5.5 U2.8(S5)
TCLK_MCU6: P6.5 U2.7(S6)
TCLK_MCU7: P7.5 U2.6(S7)
TCLK_MCU8: P8.5 U2.5(S8)
TCLK_MCU9: P9.5 U2.4(S9)
TCLK_MCU10: P10.5 U2.3(S10)
TCLK_MCU11: P11.5 U2.2(S11)
TCLK_MCU12: P12.5 U2.1(S12)
TCLK_MCU13: P13.5 U2.48(S13)
TCLK_MCU14: P14.5 U2.47(S14)
TCLK_MCU15: P15.5 U2.46(S15)
TCLK_MCU16: P16.5 U2.45(S16)
TCLK_MCU17: P17.5 U2.25(S17)
TCLK_MCU18: P18.5 U2.26(S18)
TCLK_MCU19: P19.5 U2.27(S19)
TCLK_MCU20: P20.5 U2.28(S20)
TCLK_MCU21: P21.5 U2.29(S21)
TCLK_MCU22: P22.5 U2.30(S22)
TCLK_MCU23: P23.5 U2.31(S23)
TCLK_MCU24: P24.5 U2.32(S24)
TCLK_MCU25: P25.5 U2.33(S25)
TCLK_MCU26: P26.5 U2.34(S26)
TCLK_MCU27: P27.5 U2.35(S27)
TCLK_MCU28: P28.5 U2.36(S28)
TCLK_MCU29: P29.5 U2.37(S29)
TCLK_MCU30: P30.5 U2.38(S30)
TCLK_MCU31: P31.5 U2.39(S31)
TCLK_MCU32: P32.5 U2.40(S32)
TDI: U4.43(D) U20.1(RO)
TDI_A: P35.3 R41.1 R44.2 U20.6(A)
TDI_B: P35.4 R41.2 R43.1 U20.7(B)
TDI_MCU1: P1.3 U4.12(S1)
TDI_MCU2: P2.3 U4.11(S2)
TDI_MCU3: P3.3 U4.10(S3)
TDI_MCU4: P4.3 U4.9(S4)
TDI_MCU5: P5.3 U4.8(S5)
TDI_MCU6: P6.3 U4.7(S6)
TDI_MCU7: P7.3 U4.6(S7)
TDI_MCU8: P8.3 U4.5(S8)
TDI_MCU9: P9.3 U4.4(S9)
TDI_MCU10: P10.3 U4.3(S10)
TDI_MCU11: P11.3 U4.2(S11)
TDI_MCU12: P12.3 U4.1(S12)
TDI_MCU13: P13.3 U4.48(S13)
TDI_MCU14: P14.3 U4.47(S14)
TDI_MCU15: P15.3 U4.46(S15)
TDI_MCU16: P16.3 U4.45(S16)
TDI_MCU17: P17.3 U4.25(S17)
TDI_MCU18: P18.3 U4.26(S18)
TDI_MCU19: P19.3 U4.27(S19)
TDI_MCU20: P20.3 U4.28(S20)
TDI_MCU21: P21.3 U4.29(S21)
TDI_MCU22: P22.3 U4.30(S22)
TDI_MCU23: P23.3 U4.31(S23)
TDI_MCU24: P24.3 U4.32(S24)
TDI_MCU25: P25.3 U4.33(S25)
TDI_MCU26: P26.3 U4.34(S26)
TDI_MCU27: P27.3 U4.35(S27)
TDI_MCU28: P28.3 U4.36(S28)
TDI_MCU29: P29.3 U4.37(S29)
TDI_MCU30: P30.3 U4.38(S30)
TDI_MCU31: P31.3 U4.39(S31)
TDI_MCU32: P32.3 U4.40(S32)
TDO: U5.43(D) U22.4(DI)
TDO_A: P34.7 R49.1 R52.2 U22.6(A)
TDO_B: P34.8 R49.2 R51.1 U22.7(B)
TDO_MCU1: P1.1 U5.12(S1)
TDO_MCU2: P2.1 U5.11(S2)
TDO_MCU3: P3.1 U5.10(S3)
TDO_MCU4: P4.1 U5.9(S4)
TDO_MCU5: P5.1 U5.8(S5)
TDO_MCU6: P6.1 U5.7(S6)
TDO_MCU7: P7.1 U5.6(S7)
TDO_MCU8: P8.1 U5.5(S8)
TDO_MCU9: P9.1 U5.4(S9)
TDO_MCU10: P10.1 U5.3(S10)
TDO_MCU11: P11.1 U5.2(S11)
TDO_MCU12: P12.1 U5.1(S12)
TDO_MCU13: P13.1 U5.48(S13)
TDO_MCU14: P14.1 U5.47(S14)
TDO_MCU15: P15.1 U5.46(S15)
TDO_MCU16: P16.1 U5.45(S16)
TDO_MCU17: P17.1 U5.25(S17)
TDO_MCU18: P18.1 U5.26(S18)
TDO_MCU19: P19.1 U5.27(S19)
TDO_MCU20: P20.1 U5.28(S20)
TDO_MCU21: P21.1 U5.29(S21)
TDO_MCU22: P22.1 U5.30(S22)
TDO_MCU23: P23.1 U5.31(S23)
TDO_MCU24: P24.1 U5.32(S24)
TDO_MCU25: P25.1 U5.33(S25)
TDO_MCU26: P26.1 U5.34(S26)
TDO_MCU27: P27.1 U5.35(S27)
TDO_MCU28: P28.1 U5.36(S28)
TDO_MCU29: P29.1 U5.37(S29)
TDO_MCU30: P30.1 U5.38(S30)
TDO_MCU31: P31.1 U5.39(S31)
TDO_MCU32: P32.1 U5.40(S32)
TSTROBE: U3.43(D) U19.1(RO)
TSTROBE_A: P35.1 R37.1 R40.2 U19.6(A)
TSTROBE_B: P35.2 R37.2 R39.1 U19.7(B)
TSTROBE_MCU1: P1.7 U3.12(S1)
TSTROBE_MCU2: P2.7 U3.11(S2)
TSTROBE_MCU3: P3.7 U3.10(S3)
TSTROBE_MCU4: P4.7 U3.9(S4)
TSTROBE_MCU5: P5.7 U3.8(S5)
TSTROBE_MCU6: P6.7 U3.7(S6)
TSTROBE_MCU7: P7.7 U3.6(S7)
TSTROBE_MCU8: P8.7 U3.5(S8)
TSTROBE_MCU9: P9.7 U3.4(S9)
TSTROBE_MCU10: P10.7 U3.3(S10)
TSTROBE_MCU11: P11.7 U3.2(S11)
TSTROBE_MCU12: P12.7 U3.1(S12)
TSTROBE_MCU13: P13.7 U3.48(S13)
TSTROBE_MCU14: P14.7 U3.47(S14)
TSTROBE_MCU15: P15.7 U3.46(S15)
TSTROBE_MCU16: P16.7 U3.45(S16)
TSTROBE_MCU17: P17.7 U3.25(S17)
TSTROBE_MCU18: P18.7 U3.26(S18)
TSTROBE_MCU19: P19.7 U3.27(S19)
TSTROBE_MCU20: P20.7 U3.28(S20)
TSTROBE_MCU21: P21.7 U3.29(S21)
TSTROBE_MCU22: P22.7 U3.30(S22)
TSTROBE_MCU23: P23.7 U3.31(S23)
TSTROBE_MCU24: P24.7 U3.32(S24)
TSTROBE_MCU25: P25.7 U3.33(S25)
TSTROBE_MCU26: P26.7 U3.34(S26)
TSTROBE_MCU27: P27.7 U3.35(S27)
TSTROBE_MCU28: P28.7 U3.36(S28)
TSTROBE_MCU29: P29.7 U3.37(S29)
TSTROBE_MCU30: P30.7 U3.38(S30)
TSTROBE_MCU31: P31.7 U3.39(S31)
TSTROBE_MCU32: P32.7 U3.40(S32)
WR: U1.21(WR#) U2.21(WR#) U3.21(WR#) U4.21(WR#) U5.21(WR#) U6.21(WR#) U7.21(WR#) U8.21(WR#) U9.21(WR#) U16.1(RO)
WR_A: P35.5 R25.1 R28.2 U16.6(A)
WR_B: P35.6 R25.2 R27.1 U16.7(B)
$3N4213: R2.1 U10.2(RE#) U10.3(DE)
$3N4223: R6.1 U11.2(RE#) U11.3(DE)
$3N4233: R10.1 U12.2(RE#) U12.3(DE)
$3N4243: R14.1 U13.2(RE#) U13.3(DE)
$3N4253: R18.1 U14.2(RE#) U14.3(DE)
$3N4263: R22.1 U15.2(RE#) U15.3(DE)
$3N4273: R26.1 U16.2(RE#) U16.3(DE)
$3N4283: R30.1 U17.2(RE#) U17.3(DE)
$3N4293: R34.1 U18.2(RE#) U18.3(DE)
$3N4303: R38.1 U19.2(RE#) U19.3(DE)
$3N4313: R42.1 U20.2(RE#) U20.3(DE)
$3N4323: R46.1 U21.2(RE#) U21.3(DE)
$3N4333: R50.1 U22.2(RE#) U22.3(DE)
$3N4343: R54.1 U23.2(RE#) U23.3(DE)

Not connected (* = marked no-connect by the designer): J1 1*; J2 1*; J3 1*; J4 1*; J5 1*; J6 1*; J7 1*; J8 1*; J9 1*; J10 1*; J11 1*; J12 1*; J13 1*; J14 1*; J15 1*; J16 1*; J17 1*; J18 1*; J19 1*; J20 1*; J21 1*; J22 1*; J23 1*; J24 1*; J25 1*; J26 1*; J27 1*; J28 1*; J29 1*; J30 1*; J31 1*; J32 1*; J33 1*; J34 1*; J35 1*; J36 1*; U1 41(NIC)* 42(NIC)* 44(NIC)*; U2 41(NIC)* 42(NIC)* 44(NIC)*; U3 41(NIC)* 42(NIC)* 44(NIC)*; U4 41(NIC)* 42(NIC)* 44(NIC)*; U5 41(NIC)* 42(NIC)* 44(NIC)*; U6 41(NIC)* 42(NIC)* 44(NIC)*; U7 41(NIC)* 42(NIC)* 44(NIC)*; U8 41(NIC)* 42(NIC)* 44(NIC)*; U9 41(NIC)* 42(NIC)* 44(NIC)*; U10 4(DI)*; U11 4(DI)*; U12 4(DI)*; U13 4(DI)*; U14 4(DI)*; U15 4(DI)*; U16 4(DI)*; U17 4(DI)*; U18 4(DI)*; U19 4(DI)*; U20 4(DI)*; U21 4(DI)*; U22 1(RO)*; U23 1(RO)*

## Notes on the sheets
sheet 2
- MCU接收
- MCU接收
- MCU接收
- MCU接收
- MCU接收
- MCU接收
- MCU接收
- MCU接收
- MCU接收
- MCU接收
- MCU接收
- MCU接收
- MCU发送
- MCU发送

# Schematic Schematic2
Create Date: 2023-09-12; Page Name: P1; Project Name: 高低温转接板_自动化测试平台; Schematic Name: Schematic2; Update Date: 2023-09-12; Company: 嘉立创EDA; Page Size: A4; Version: V1.0
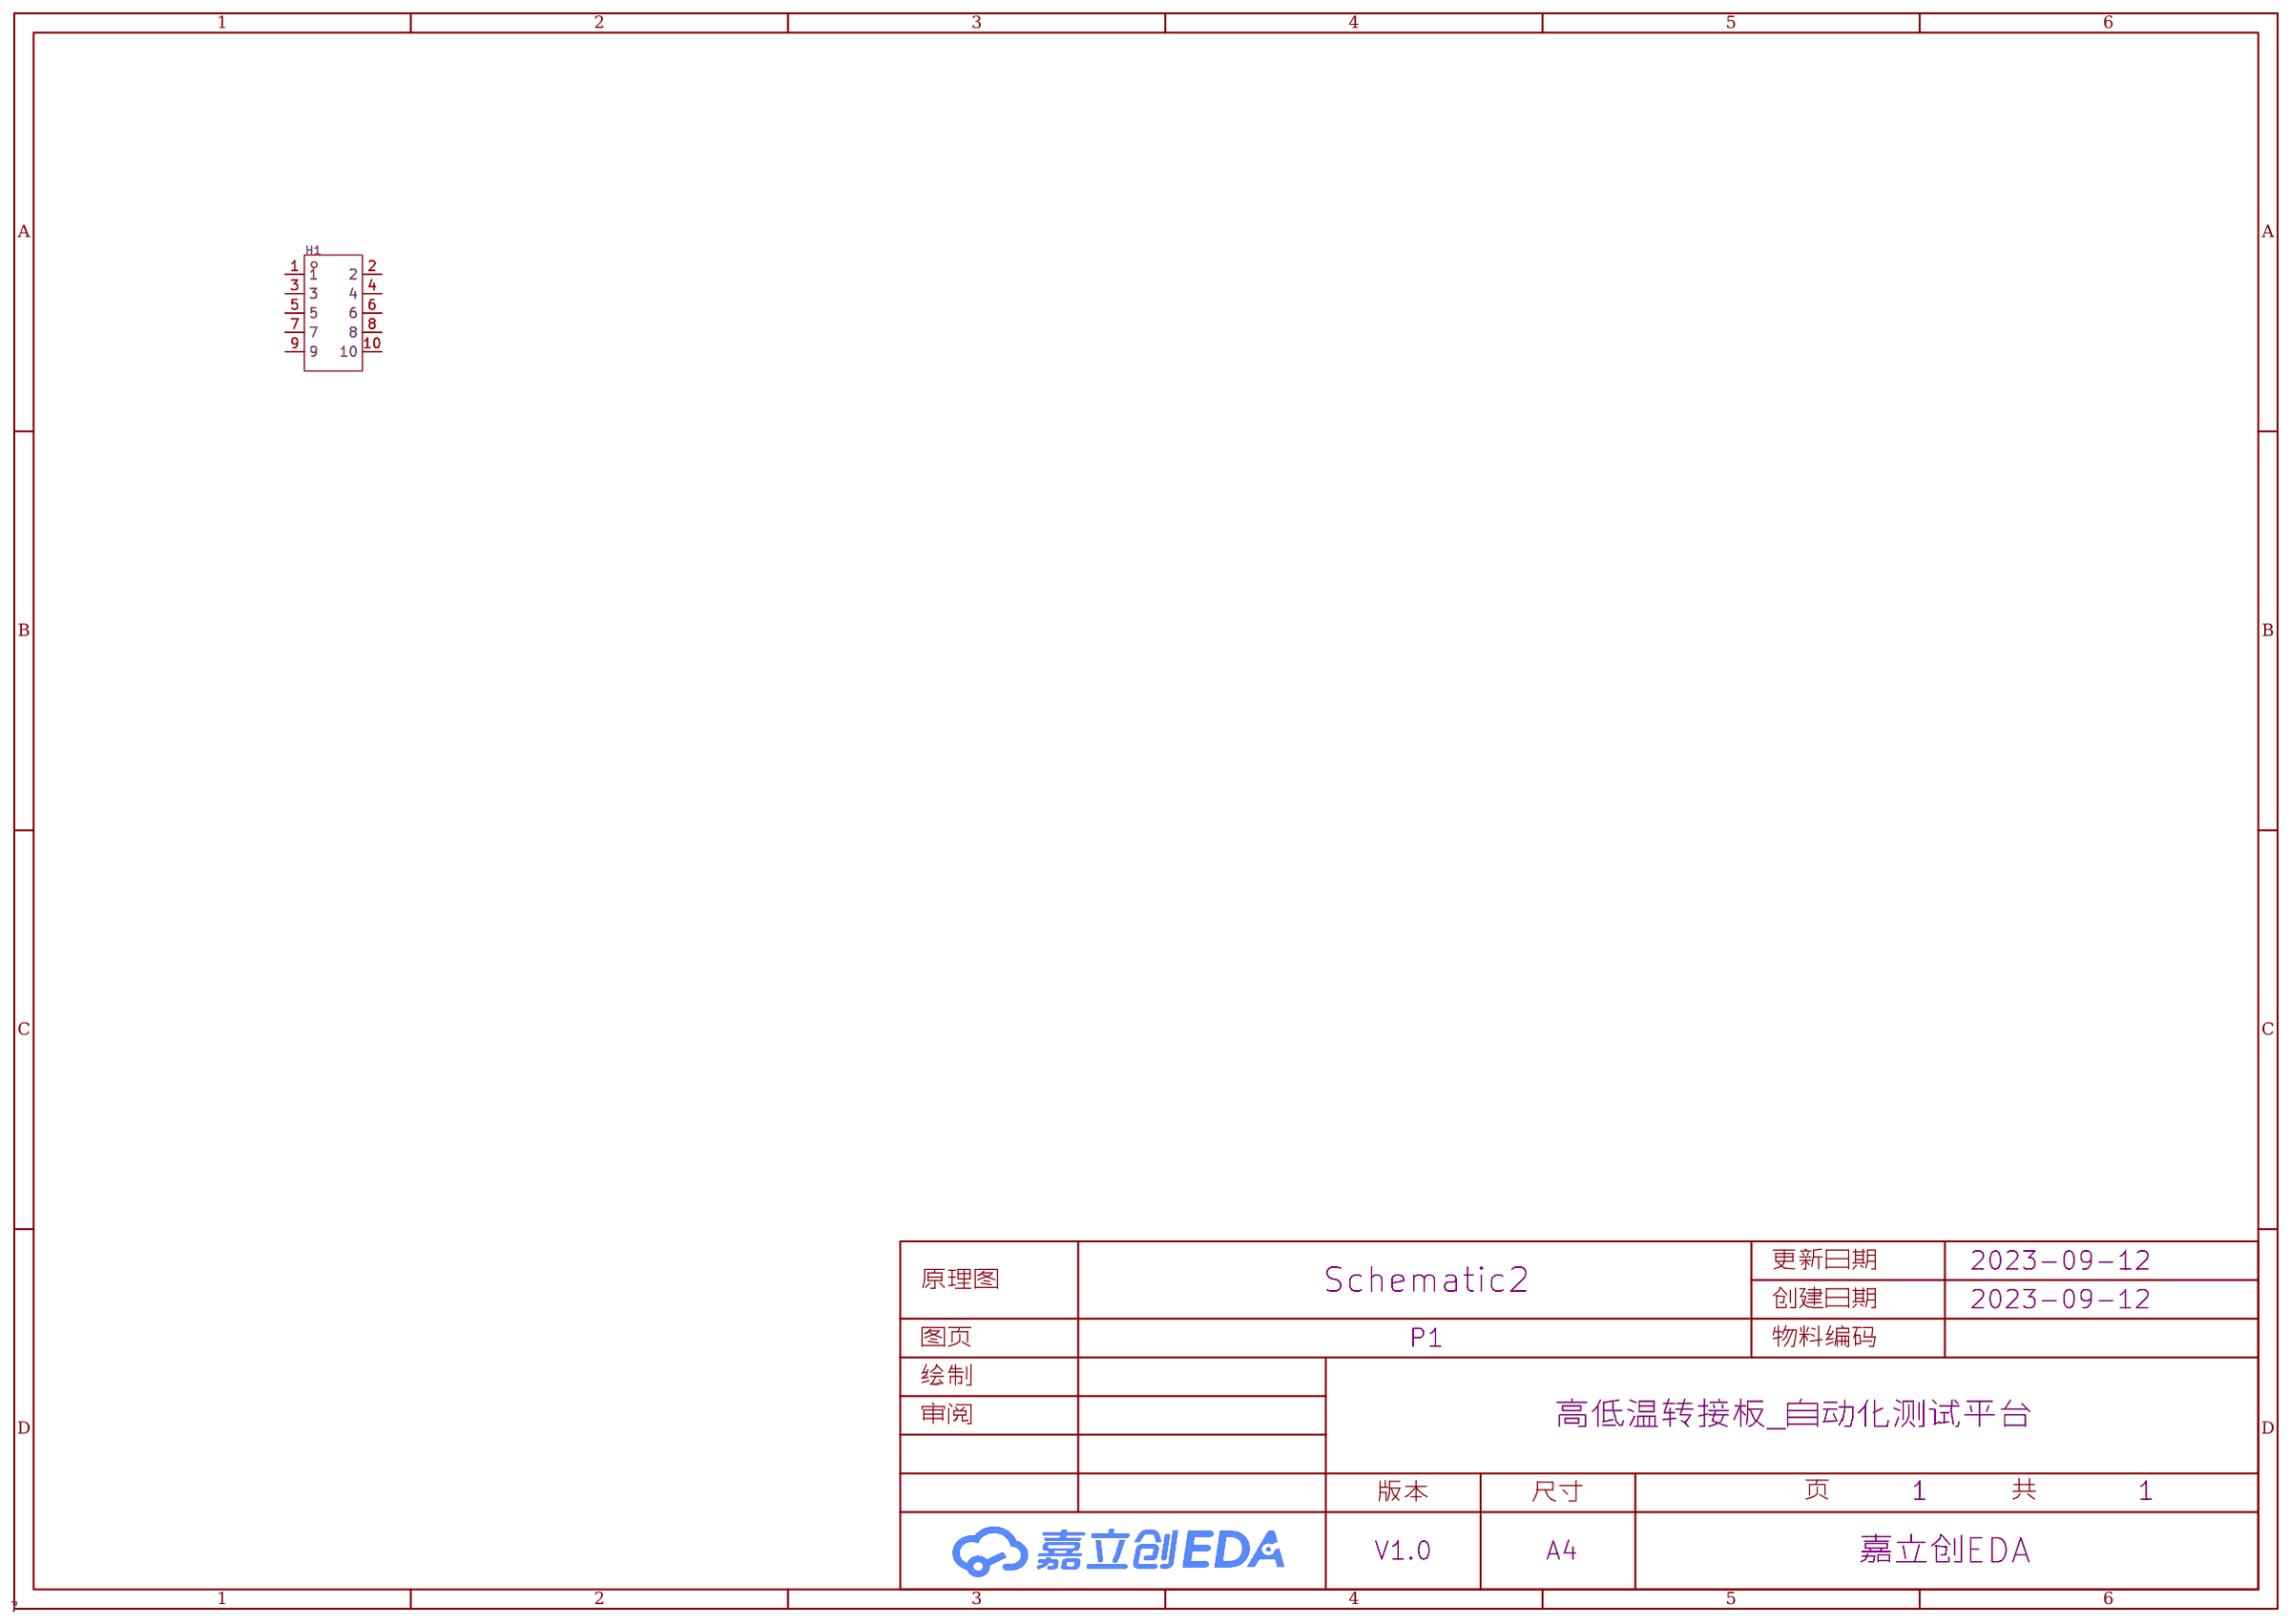
[diagram p5: schematic sheet]

## Parts
H1  MTF185-205SY3-S01  [HDR-TH_10P-P2.54-V-F-R2-C5-S2.54-1_MINTRON]

## Library data of the parts
H1 = MTF185-205SY3-S01: 排数:双排;总孔位数:10;间距:2.54mm;插孔结构:2x5P;行距:2.54mm;安装类型:直插;塑高:-;触头材质:-;触头镀层:金;; LCSC Part Name: 2.54mm 2x5P; Supplier Part: C358739; Manufacturer: MINTRON(明硕); Supplier Footprint: 插件,P=2.54mm; JLCPCB Part Class: Extended Part; Supplier: LCSC; Number of Rows: 双排; Number of Holes: 10; Pitch: 2.54mm; Holes Structure: 2x5P; Row Spacing: 2.54mm; Mounting Type: 直插; Contact Plating: 金

## Nets

Not connected (* = marked no-connect by the designer): H1 1 2 3 4 5 6 7 8 9 10

# Board PCB1
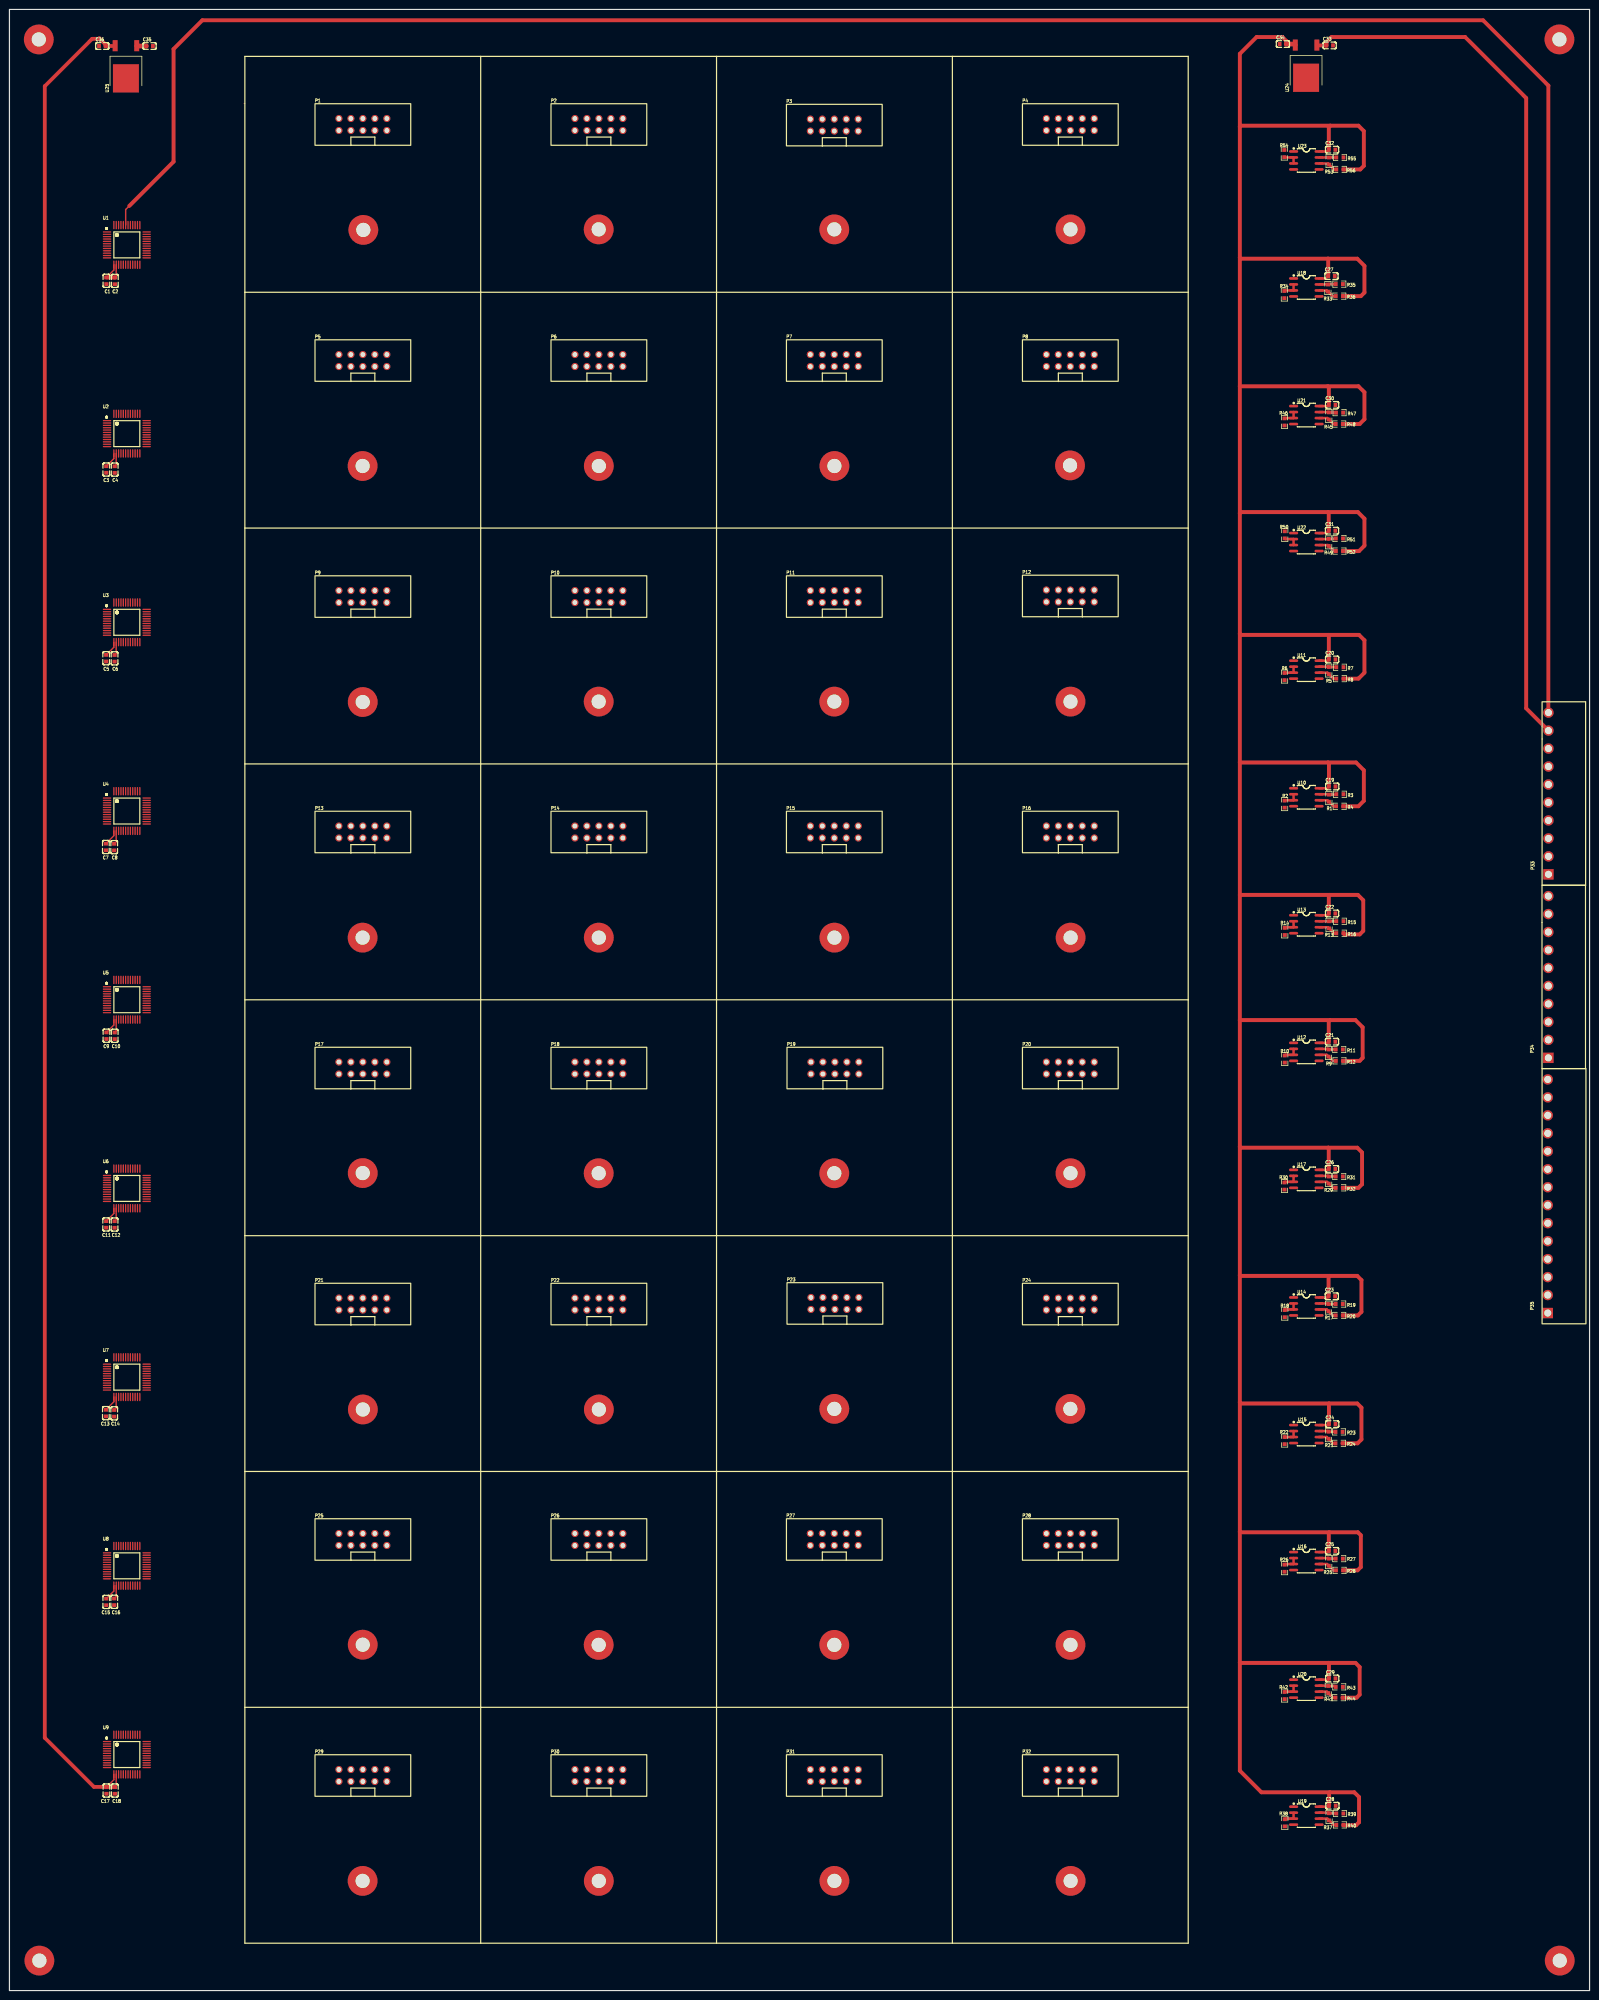
[diagram p6: board, top side]
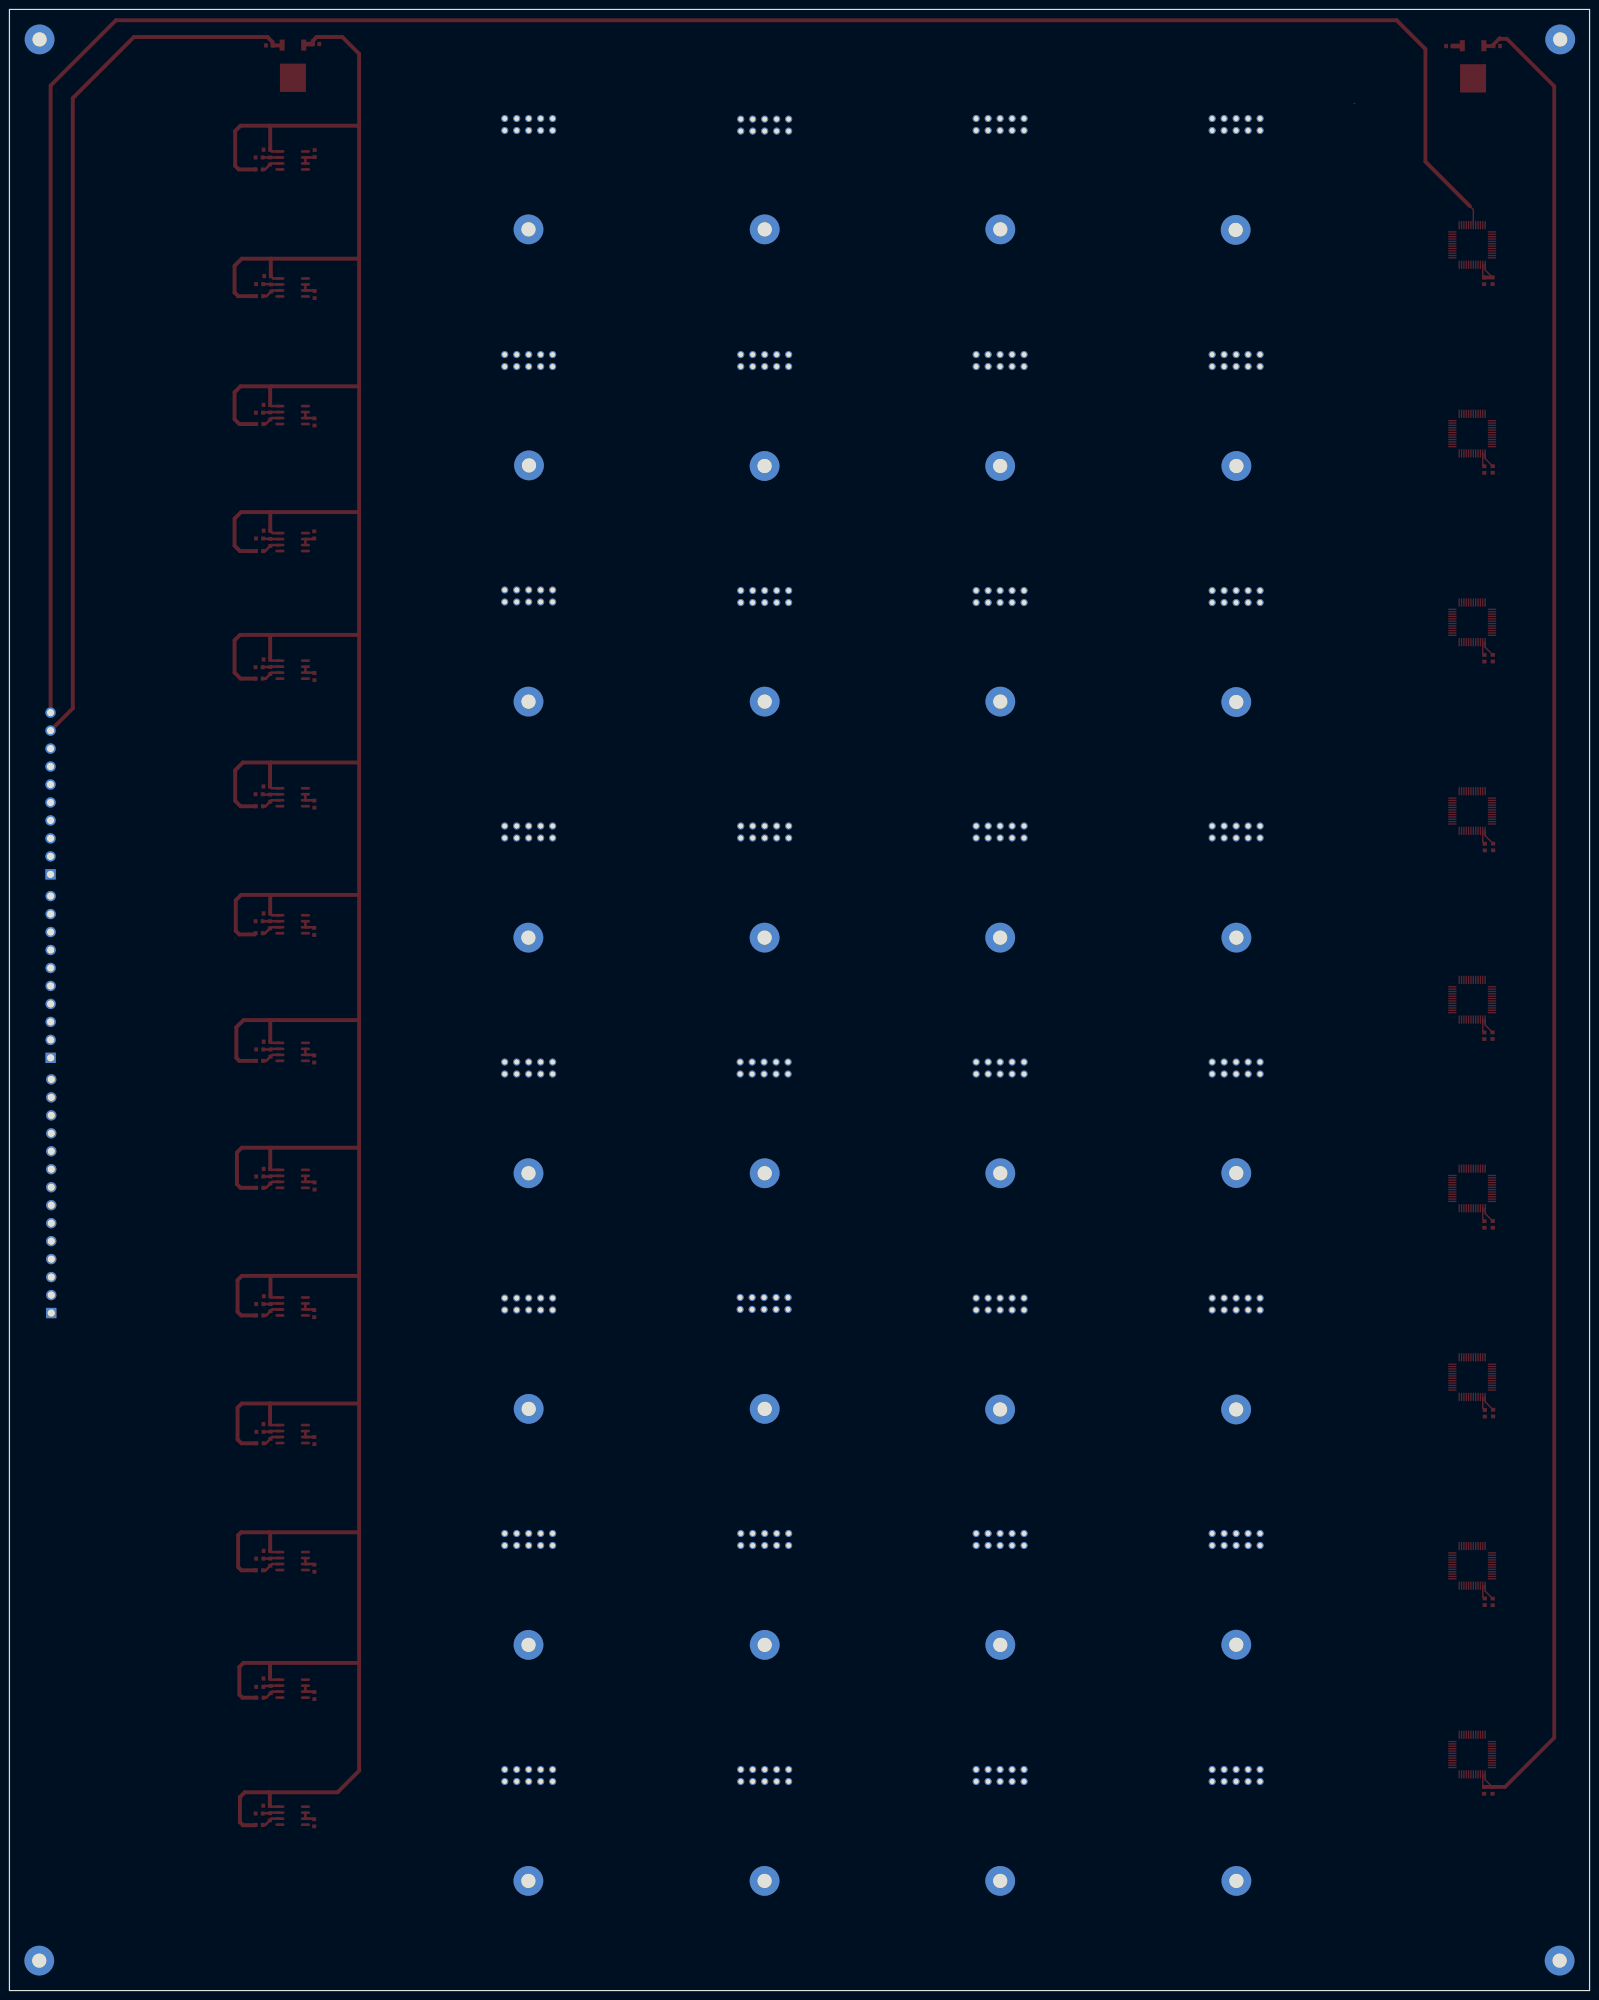
[diagram p7: board, bottom side, seen from below]

Outline 335 x 420 mm; copper layers: Top Layer, Inner1, Inner2, Bottom Layer. Coordinates in mm from the lower left corner of the outline.
Outline path: rectangle 0,420 335,0
Stack: Top Layer 0.035mm / Dielectric1 0.48mm PP er 4.5 / Inner1 0.035mm / Dielectric2 0.48mm FR4 er 4.5 / Inner2 0.035mm / Dielectric3 0.48mm PP er 4.5 / Bottom Layer 0.035mm

## Design rules (mm)
template: JLCPCB Capability(Two Layers Board)
spacing copperThickness1oz (default): track to track 0.102, other pairs 0.152 to 0.3
spacing copperThickness2oz: track to track 0.203, other pairs 0.152 to 0.3
track width copperThickness1oz (default): min 0.127, default 0.254, max 2.54
track width copperThickness2oz: min 0.203, default 0.254, max 2.54
differential pair differentialPair (default): width min 0.127, default 0.254, max 2.54; gap min 0.152, default 0.152
via viaSize (default): diameter min 0.5, default 0.61, max 10; hole min 0.3, default 0.305, max 6.3

## Placement (name value [footprint] x y rotation side)
C1  100nF  [C0603]  20.56 362.48 90 top
C2  100nF  [C0603]  22.35 362.46 90 top
C3  100nF  [C0603]  20.54 322.47 90 top
C4  100nF  [C0603]  22.31 322.45 90 top
C5  100nF  [C0603]  20.51 282.47 90 top
C6  100nF  [C0603]  22.29 282.45 90 top
C7  100nF  [C0603]  20.45 242.44 90 top
C8  100nF  [C0603]  22.21 242.42 90 top
C9  100nF  [C0603]  20.57 202.44 90 top
C10  100nF  [C0603]  22.31 202.41 90 top
C11  100nF  [C0603]  20.51 162.43 90 top
C12  100nF  [C0603]  22.29 162.41 90 top
C13  100nF  [C0603]  20.45 122.43 90 top
C14  100nF  [C0603]  22.21 122.38 90 top
C15  100nF  [C0603]  20.54 82.4 90 top
C16  100nF  [C0603]  22.22 82.42 90 top
C17  100nF  [C0603]  20.57 42.42 90 top
C18  100nF  [C0603]  22.35 42.42 90 top
C19  10uF  [C0603]  280.45 255.27 0 top
C20  10uF  [C0603]  280.42 282.19 0 top
C21  10uF  [C0603]  280.4 201.17 0 top
C22  10uF  [C0603]  280.42 228.35 0 top
C23  10uF  [C0603]  280.36 147.19 0 top
C24  10uF  [C0603]  280.45 120.09 0 top
C25  10uF  [C0603]  280.42 93.22 0 top
C26  10uF  [C0603]  280.4 174.19 0 top
C27  10uF  [C0603]  280.29 363.47 0 top
C28  10uF  [C0603]  280.49 39.19 0 top
C29  10uF  [C0603]  280.45 66.16 0 top
C30  10uF  [C0603]  280.42 336.17 0 top
C31  10uF  [C0603]  280.4 309.5 0 top
C32  10uF  [C0603]  280.42 390.27 0 top
C33  10uF  [C0603]  279.91 412.37 0 top
C34  10uF  [C0603]  270 412.66 0 top
C35  10uF  [C0603]  29.72 412.24 0 top
C36  10uF  [C0603]  19.68 412.24 0 top
J1  -  [DEMO板安装孔]  75.03 373.26 0 top
J2  -  [DEMO板安装孔]  124.93 373.37 0 top
J3  -  [DEMO板安装孔]  174.88 373.37 0 top
J4  -  [DEMO板安装孔]  224.95 373.37 0 top
J5  -  [DEMO板安装孔]  74.88 323.21 0 top
J6  -  [DEMO板安装孔]  124.95 323.21 0 top
J7  -  [DEMO板安装孔]  174.9 323.21 0 top
J8  -  [DEMO板安装孔]  224.85 323.34 0 top
J9  -  [DEMO板安装孔]  74.9 273.17 0 top
J10  -  [DEMO板安装孔]  124.93 273.26 0 top
J11  -  [DEMO板安装孔]  174.88 273.26 0 top
J12  -  [DEMO板安装孔]  224.95 273.26 0 top
J13  -  [DEMO板安装孔]  74.88 223.22 0 top
J14  -  [DEMO板安装孔]  124.95 223.22 0 top
J15  -  [DEMO板安装孔]  174.9 223.22 0 top
J16  -  [DEMO板安装孔]  224.98 223.22 0 top
J17  -  [DEMO板安装孔]  74.9 173.31 0 top
J18  -  [DEMO板安装孔]  124.93 173.27 0 top
J19  -  [DEMO板安装孔]  174.88 173.27 0 top
J20  -  [DEMO板安装孔]  224.95 173.27 0 top
J21  -  [DEMO板安装孔]  74.93 123.19 0 top
J22  -  [DEMO板安装孔]  124.97 123.19 0 top
J23  -  [DEMO板安装孔]  174.88 123.32 0 top
J24  -  [DEMO板安装孔]  224.92 123.32 0 top
J25  -  [DEMO板安装孔]  74.9 73.32 0 top
J26  -  [DEMO板安装孔]  124.93 73.28 0 top
J27  -  [DEMO板安装孔]  174.88 73.28 0 top
J28  -  [DEMO板安装孔]  224.95 73.28 0 top
J29  -  [DEMO板安装孔]  74.88 23.25 0 top
J30  -  [DEMO板安装孔]  124.95 23.25 0 top
J31  -  [DEMO板安装孔]  174.9 23.25 0 top
J32  -  [DEMO板安装孔]  224.98 23.25 0 top
J33  -  [DEMO板安装孔]  6.22 413.64 0 top
J34  -  [DEMO板安装孔]  328.68 6.35 0 top
J35  -  [DEMO板安装孔]  6.35 6.35 0 top
J36  -  [DEMO板安装孔]  328.61 413.64 0 top
P1  2.54-2*5P简牛  [IDC-TH_10P-P2.54_C5665]  74.93 395.6 0 top
P2  2.54-2*5P简牛  [IDC-TH_10P-P2.54_C5665]  124.97 395.6 0 top
P3  2.54-2*5P简牛  [IDC-TH_10P-P2.54_C5665]  174.88 395.48 0 top
P4  2.54-2*5P简牛  [IDC-TH_10P-P2.54_C5665]  224.92 395.6 0 top
P5  2.54-2*5P简牛  [IDC-TH_10P-P2.54_C5665]  74.93 345.57 0 top
P6  2.54-2*5P简牛  [IDC-TH_10P-P2.54_C5665]  124.97 345.57 0 top
P7  2.54-2*5P简牛  [IDC-TH_10P-P2.54_C5665]  174.88 345.57 0 top
P8  2.54-2*5P简牛  [IDC-TH_10P-P2.54_C5665]  224.92 345.57 0 top
P9  2.54-2*5P简牛  [IDC-TH_10P-P2.54_C5665]  74.93 295.53 0 top
P10  2.54-2*5P简牛  [IDC-TH_10P-P2.54_C5665]  124.97 295.53 0 top
P11  2.54-2*5P简牛  [IDC-TH_10P-P2.54_C5665]  174.88 295.53 0 top
P12  2.54-2*5P简牛  [IDC-TH_10P-P2.54_C5665]  224.92 295.66 0 top
P13  2.54-2*5P简牛  [IDC-TH_10P-P2.54_C5665]  74.93 245.62 0 top
P14  2.54-2*5P简牛  [IDC-TH_10P-P2.54_C5665]  124.97 245.62 0 top
P15  2.54-2*5P简牛  [IDC-TH_10P-P2.54_C5665]  174.88 245.62 0 top
P16  2.54-2*5P简牛  [IDC-TH_10P-P2.54_C5665]  224.92 245.62 0 top
P17  2.54-2*5P简牛  [IDC-TH_10P-P2.54_C5665]  74.93 195.58 0 top
P18  2.54-2*5P简牛  [IDC-TH_10P-P2.54_C5665]  124.97 195.58 0 top
P19  2.54-2*5P简牛  [IDC-TH_10P-P2.54_C5665]  175.01 195.58 0 top
P20  2.54-2*5P简牛  [IDC-TH_10P-P2.54_C5665]  224.92 195.58 0 top
P21  2.54-2*5P简牛  [IDC-TH_10P-P2.54_C5665]  74.93 145.54 0 top
P22  2.54-2*5P简牛  [IDC-TH_10P-P2.54_C5665]  124.97 145.54 0 top
P23  2.54-2*5P简牛  [IDC-TH_10P-P2.54_C5665]  175.01 145.67 0 top
P24  2.54-2*5P简牛  [IDC-TH_10P-P2.54_C5665]  224.92 145.54 0 top
P25  2.54-2*5P简牛  [IDC-TH_10P-P2.54_C5665]  74.93 95.63 0 top
P26  2.54-2*5P简牛  [IDC-TH_10P-P2.54_C5665]  124.97 95.63 0 top
P27  2.54-2*5P简牛  [IDC-TH_10P-P2.54_C5665]  174.88 95.63 0 top
P28  2.54-2*5P简牛  [IDC-TH_10P-P2.54_C5665]  224.92 95.63 0 top
P29  2.54-2*5P简牛  [IDC-TH_10P-P2.54_C5665]  74.93 45.59 0 top
P30  2.54-2*5P简牛  [IDC-TH_10P-P2.54_C5665]  124.97 45.59 0 top
P31  2.54-2*5P简牛  [IDC-TH_10P-P2.54_C5665]  174.88 45.59 0 top
P32  2.54-2*5P简牛  [IDC-TH_10P-P2.54_C5665]  224.92 45.59 0 top
P33  WJ15EDGRC-3.81-10P  [CONN-TH_10P-P3.81_WJ15EDGRC-3.81-10P]  326.28 253.78 90 top
P34  WJ15EDGRC-3.81-10P  [CONN-TH_10P-P3.81_WJ15EDGRC-3.81-10P]  326.26 214.88 90 top
P35  WJ15EDGRC-3.81-14P  [CONN-TH_14P-P3.81_WJ15EDGRC-3.81-14P]  326.14 168.4 90 top
R1  120Ω  [R0603]  279.73 252.79 90 top
R2  4.7kΩ  [R0603]  270.35 251.52 270 top
R3  4.7kΩ  [R0603]  282.07 253.62 0 top
R4  4.7kΩ  [R0603]  282.02 251.07 180 top
R5  120Ω  [R0603]  279.71 279.84 90 top
R6  4.7kΩ  [R0603]  270.34 278.56 270 top
R7  4.7kΩ  [R0603]  282.07 280.54 0 top
R8  4.7kΩ  [R0603]  282.07 278.13 180 top
R9  120Ω  [R0603]  279.65 198.75 90 top
R10  4.7kΩ  [R0603]  270.38 197.48 270 top
R11  4.7kΩ  [R0603]  281.94 199.52 0 top
R12  4.7kΩ  [R0603]  281.98 197.1 180 top
R13  120Ω  [R0603]  279.77 225.94 90 top
R14  4.7kΩ  [R0603]  270.38 224.54 270 top
R15  4.7kΩ  [R0603]  282.07 226.69 0 top
R16  4.7kΩ  [R0603]  282.07 224.15 180 top
R17  120Ω  [R0603]  279.65 144.78 90 top
R18  4.7kΩ  [R0603]  270.38 143.51 270 top
R19  4.7kΩ  [R0603]  281.93 145.54 0 top
R20  4.7kΩ  [R0603]  281.94 143.13 180 top
R21  120Ω  [R0603]  279.65 117.73 90 top
R22  4.7kΩ  [R0603]  270.35 116.59 270 top
R23  4.7kΩ  [R0603]  281.89 118.44 0 top
R24  4.7kΩ  [R0603]  281.89 116.02 180 top
R25  120Ω  [R0603]  279.7 90.82 90 top
R26  4.7kΩ  [R0603]  270.34 89.53 270 top
R27  4.7kΩ  [R0603]  281.94 91.57 0 top
R28  4.7kΩ  [R0603]  282 89.09 180 top
R29  120Ω  [R0603]  279.69 171.84 90 top
R30  4.7kΩ  [R0603]  270.32 170.56 270 top
R31  4.7kΩ  [R0603]  281.94 172.59 0 top
R32  4.7kΩ  [R0603]  281.94 170.18 180 top
R33  120Ω  [R0603]  279.53 360.93 90 top
R34  4.7kΩ  [R0603]  270.29 359.55 270 top
R35  4.7kΩ  [R0603]  281.95 361.77 0 top
R36  4.7kΩ  [R0603]  281.95 359.22 180 top
R37  120Ω  [R0603]  279.77 36.84 90 top
R38  4.7kΩ  [R0603]  270.39 35.57 270 top
R39  4.7kΩ  [R0603]  282.06 37.54 0 top
R40  4.7kΩ  [R0603]  282.06 35.12 180 top
R41  120Ω  [R0603]  279.61 63.81 90 top
R42  4.7kΩ  [R0603]  270.35 62.54 270 top
R43  4.7kΩ  [R0603]  281.94 64.39 0 top
R44  4.7kΩ  [R0603]  281.89 62.09 180 top
R45  120Ω  [R0603]  279.71 333.81 90 top
R46  4.7kΩ  [R0603]  270.33 332.54 270 top
R47  4.7kΩ  [R0603]  282 334.51 0 top
R48  4.7kΩ  [R0603]  281.94 332.1 180 top
R49  120Ω  [R0603]  279.69 307.02 90 top
R50  4.7kΩ  [R0603]  270.38 308.61 90 top
R51  4.7kΩ  [R0603]  281.98 307.84 0 top
R52  4.7kΩ  [R0603]  281.98 305.17 180 top
R53  120Ω  [R0603]  279.78 387.86 90 top
R54  4.7kΩ  [R0603]  270.29 389.44 90 top
R55  4.7kΩ  [R0603]  282.07 388.62 0 top
R56  4.7kΩ  [R0603]  282.07 386.08 180 top
U1  ADG732BSUZ-REEL  [TQFP-48_L7.0-W7.0-P0.50-LS9.0-TL]  24.89 370.08 0 top
U2  ADG732BSUZ-REEL  [TQFP-48_L7.0-W7.0-P0.50-LS9.0-TL]  24.89 330.07 0 top
U3  ADG732BSUZ-REEL  [TQFP-48_L7.0-W7.0-P0.50-LS9.0-TL]  24.89 290.07 0 top
U4  ADG732BSUZ-REEL  [TQFP-48_L7.0-W7.0-P0.50-LS9.0-TL]  24.89 250.06 0 top
U5  ADG732BSUZ-REEL  [TQFP-48_L7.0-W7.0-P0.50-LS9.0-TL]  24.89 210.06 0 top
U6  ADG732BSUZ-REEL  [TQFP-48_L7.0-W7.0-P0.50-LS9.0-TL]  24.89 170.05 0 top
U7  ADG732BSUZ-REEL  [TQFP-48_L7.0-W7.0-P0.50-LS9.0-TL]  24.89 130.05 0 top
U8  ADG732BSUZ-REEL  [TQFP-48_L7.0-W7.0-P0.50-LS9.0-TL]  24.89 90.04 0 top
U9  ADG732BSUZ-REEL  [TQFP-48_L7.0-W7.0-P0.50-LS9.0-TL]  24.89 50.04 0 top
U10  SP485EEN-L/TR  [SOIC-8_L5.0-W4.0-P1.27-LS6.0-BL]  274.95 252.98 270 top
U11  SP485EEN-L/TR  [SOIC-8_L5.0-W4.0-P1.27-LS6.0-BL]  274.95 280.03 270 top
U12  SP485EEN-L/TR  [SOIC-8_L5.0-W4.0-P1.27-LS6.0-BL]  274.95 199.01 270 top
U13  SP485EEN-L/TR  [SOIC-8_L5.0-W4.0-P1.27-LS6.0-BL]  274.95 226.06 270 top
U14  SP485EEN-L/TR  [SOIC-8_L5.0-W4.0-P1.27-LS6.0-BL]  274.95 145.03 270 top
U15  SP485EEN-L/TR  [SOIC-8_L5.0-W4.0-P1.27-LS6.0-BL]  274.95 117.98 270 top
U16  SP485EEN-L/TR  [SOIC-8_L5.0-W4.0-P1.27-LS6.0-BL]  274.95 91.06 270 top
U17  SP485EEN-L/TR  [SOIC-8_L5.0-W4.0-P1.27-LS6.0-BL]  274.95 172.08 270 top
U18  SP485EEN-L/TR  [SOIC-8_L5.0-W4.0-P1.27-LS6.0-BL]  274.95 361.06 270 top
U19  SP485EEN-L/TR  [SOIC-8_L5.0-W4.0-P1.27-LS6.0-BL]  274.95 37.08 270 top
U20  SP485EEN-L/TR  [SOIC-8_L5.0-W4.0-P1.27-LS6.0-BL]  274.95 64.01 270 top
U21  SP485EEN-L/TR  [SOIC-8_L5.0-W4.0-P1.27-LS6.0-BL]  274.95 334.01 270 top
U22  SP485EEN-L/TR  [SOIC-8_L5.0-W4.0-P1.27-LS6.0-BL]  274.95 307.09 270 top
U23  SP485EEN-L/TR  [SOIC-8_L5.0-W4.0-P1.27-LS6.0-BL]  274.95 387.99 270 top
U24  CJ7805 3%  [TO-252-2_L6.6-W6.1-P4.58-LS10.1-BR-CW]  274.9 408.98 90 top
U25  CJ7805 3%  [TO-252-2_L6.6-W6.1-P4.58-LS10.1-BR-CW]  24.7 408.85 90 top

## Footprints (pads in the part's own frame, mm; a bottom-side part is the same pattern mirrored in y, then rotated)
C0603
  rect 0.8x0.9 smd: 1(-0.7,0) 2(0.7,0)
CONN-TH_10P-P3.81_WJ15EDGRC-3.81-10P
  rect 2.2x2.2 hole 1.5: 1(-17.145,0)
  round 2.2 hole 1.5: 2(-13.335,0) 3(-9.525,0) 4(-5.715,0) 5(-1.905,0) 6(1.905,0) 7(5.715,0) 8(9.525,0) 9(13.335,0) 10(17.145,0)
CONN-TH_14P-P3.81_WJ15EDGRC-3.81-14P
  rect 2.2x2.2 hole 1.5: 1(-24.765,0)
  round 2.2 hole 1.5: 2(-20.955,0) 3(-17.145,0) 4(-13.335,0) 5(-9.525,0) 6(-5.715,0) 7(-1.905,0) 8(1.905,0) 9(5.715,0) 10(9.525,0) 11(13.335,0) 12(17.145,0) 13(20.955,0) 14(24.765,0)
DEMO板安装孔
  round 6.32 hole 3: 1(0,0)
IDC-TH_10P-P2.54_C5665
  round 1.524 hole 1: 1(-5.08,-1.27) 2(-5.08,1.27) 3(-2.54,-1.27) 4(-2.54,1.27) 5(0,-1.27) 6(0,1.27) 7(2.54,-1.27) 8(2.54,1.27) 9(5.08,-1.27) 10(5.08,1.27)
R0603
  rect 0.806x0.864 smd: 1(-0.753,0) 2(0.753,0)
SOIC-8_L5.0-W4.0-P1.27-LS6.0-BL
  oval 0.569x1.95 smd: 1(-1.905,-2.705) 2(-0.635,-2.705) 3(0.635,-2.705) 4(1.905,-2.705) 5(1.905,2.705) 6(0.635,2.705) 7(-0.635,2.705) 8(-1.905,2.705)
TO-252-2_L6.6-W6.1-P4.58-LS10.1-BR-CW
  rect 2.364x1.064 smd: 1(3.462,-2.286) 3(3.462,2.286)
  rect 6.004x5.512 smd: 2(-3.462,0)
TQFP-48_L7.0-W7.0-P0.50-LS9.0-TL
  oval 1.8x0.28 smd: 1(-4.2,2.75) 2(-4.2,2.25) 3(-4.2,1.75) 4(-4.2,1.25) 5(-4.2,0.75) 6(-4.2,0.25) 7(-4.2,-0.25) 8(-4.2,-0.75) 9(-4.2,-1.25) 10(-4.2,-1.75) 11(-4.2,-2.25) 12(-4.2,-2.75) 25(4.2,-2.75) 26(4.2,-2.25) 27(4.2,-1.75) 28(4.2,-1.25) 29(4.2,-0.75) 30(4.2,-0.25) 31(4.2,0.25) 32(4.2,0.75) 33(4.2,1.25) 34(4.2,1.75) 35(4.2,2.25) 36(4.2,2.75)
  oval 0.28x1.8 smd: 13(-2.75,-4.2) 14(-2.25,-4.2) 15(-1.75,-4.2) 16(-1.25,-4.2) 17(-0.75,-4.2) 18(-0.25,-4.2) 19(0.25,-4.2) 20(0.75,-4.2) 21(1.25,-4.2) 22(1.75,-4.2) 23(2.25,-4.2) 24(2.75,-4.2) 37(2.75,4.2) 38(2.25,4.2) 39(1.75,4.2) 40(1.25,4.2) 41(0.75,4.2) 42(0.25,4.2) 43(-0.25,4.2) 44(-0.75,4.2) 45(-1.25,4.2) 46(-1.75,4.2) 47(-2.25,4.2) 48(-2.75,4.2)

## Nets
As in the schematic.

Pads without a net: J1 1; J2 1; J3 1; J4 1; J5 1; J6 1; J7 1; J8 1; J9 1; J10 1; J11 1; J12 1; J13 1; J14 1; J15 1; J16 1; J17 1; J18 1; J19 1; J20 1; J21 1; J22 1; J23 1; J24 1; J25 1; J26 1; J27 1; J28 1; J29 1; J30 1; J31 1; J32 1; J33 1; J34 1; J35 1; J36 1; U1 41 42 44; U2 41 42 44; U3 41 42 44; U4 41 42 44; U5 41 42 44; U6 41 42 44; U7 41 42 44; U8 41 42 44; U9 41 42 44; U10 4; U11 4; U12 4; U13 4; U14 4; U15 4; U16 4; U17 4; U18 4; U19 4; U20 4; U21 4; U22 1; U23 1

## Routing (per net, layer and track width the routed paths; a pad name or vN(x,y) marks a point on that pad's centre or on a via; arc(x,y) is an arc through that point)
A0_A: length 4.1
  Top Layer w0.54: R4.2 280.7,251.07 R1.1 279.42,252.35 U10.6
A0_B: length 3.7
  Top Layer w0.54: U10.7 279.66,253.62 R1.2 281.24,253.54 R3.1
A1_A: length 4.2
  Top Layer w0.54: U11.6 279.4,279.4 R5.1 280.67,278.13 R8.2
A1_B: length 3.7
  Top Layer w0.54: U11.7 279.64,280.67 R5.2 281.26,280.6 R7.1
A2_A: length 4.1
  Top Layer w0.54: 281.22,197.1 280.56,197.1 R9.1 279.28,198.37 U12.6
A2_B: length 3.6
  Top Layer w0.54: U12.7 279.52,199.64 R9.2 281.18,199.51 R11.1
A3_A: length 4.2
  Top Layer w0.54: R16.2 280.81,224.15 R13.1 279.54,225.42 277.66,225.42
A3_B: length 3.7
  Top Layer w0.54: R15.1 R13.2 U13.7
A4_A: length 4.1
  Top Layer w0.54: R20.2 280.55,143.13 R17.1 279.28,144.4 277.66,144.4
A4_B: length 3.6
  Top Layer w0.54: R19.1 281.17,145.53 R17.2 279.52,145.67 U14.7
CS_A: length 4.1
  Top Layer w0.54: R32.2 280.59,170.18 R29.1 279.32,171.45 U17.6
CS_B: length 3.6
  Top Layer w0.54: R31.1 281.18,172.59 R29.2 279.56,172.72 U17.7
DC_12V: length 189
  Top Layer w0.83: U24.1 277.25,412.37 C33.1 279.21,413.07 280.29,414.15 308.61,414.15 321.56,401.19 321.56,271.84 P33.9
  Top Layer w1: C35.1 27.06,412.24 U25.1
EN_A: length 4
  Top Layer w0.54: U15.6 279.28,117.35 R21.1 280.61,116.02 R24.2
EN_B: length 3.6
  Top Layer w0.54: R23.1 281.09,118.48 R21.2 279.52,118.62 U15.7
LDO_5V_485: length 993.8
  Top Layer w0.54: U20.8 279.5,65.91 C29.1 ; C20.1 279.47,281.94 U11.8 ; C24.1 279.55,119.89 U15.8 ; C28.1 279.59,38.99 U19.8 ; C31.1 279.2,308.99 277.66,308.99 ; U13.8 279.33,227.96 C22.1 ; U12.8 279.45,200.91 C21.1 ; U23.8 279.33,389.89 C32.1 ; U10.8 279.36,254.89 C19.1 ; 277.66,335.91 279.47,335.91 C30.1 ; U18.8 279.08,362.97 C27.1 ; U16.8 279.46,92.96 C25.1 ; C26.1 279.5,173.99 U17.8 ; C23.1 279.41,146.94 U14.8
  Top Layer w0.83: 279.83,97.15 285.88,97.15 286.51,96.52 286.51,89.79 285.81,89.09 R28.1 ; 279.83,97.15 279.72,97.04 C25.1 ; 279.83,97.15 260.93,97.15 260.86,97.23 ; C28.1 279.79,41.86 279.96,42.04 ; 260.86,151.64 260.86,178.89 ; 260.86,151.64 260.86,124.72 ; 260.86,151.64 260.99,151.51 279.87,151.51 ; 260.86,178.89 261.06,178.69 279.64,178.69 ; 260.86,178.89 260.86,205.75 ; R44.1 285.61,62.09 286.26,62.74 286.26,68.58 285.37,69.47 279.6,69.47 ; 279.8,232.28 279.72,232.2 C22.1 ; 279.8,232.28 285.88,232.28 287.02,231.14 287.02,224.66 286.26,223.9 283.07,223.9 R16.1 ; 279.8,232.28 260.86,232.28 ; 260.86,205.75 260.87,205.74 279.89,205.74 ; 260.86,205.75 260.86,260.39 ; 260.86,69.57 260.86,97.23 ; 260.86,69.57 260.86,46.61 265.43,42.04 279.96,42.04 ; 260.86,69.57 260.96,69.47 279.6,69.47 ; 260.86,97.23 260.86,124.72 ; 279.55,367.16 279.59,367.12 C27.1 ; 279.55,367.16 285.75,367.16 287.27,365.63 287.27,359.98 286.51,359.22 R36.1 ; 279.55,367.16 261.08,367.16 260.86,367.38 ; C34.2 270.7,413.32 269.88,414.15 264.41,414.15 260.86,410.59 260.86,395.1 ; 260.86,124.72 261.12,124.46 279.78,124.46 ; C32.1 279.72,395.04 280.02,395.35 ; R8.1 286,278.13 287.27,279.4 287.27,286.26 286.13,287.4 279.57,287.4 ; 260.86,340.14 260.89,340.11 279.47,340.11 ; 260.86,340.14 260.86,313.22 ; 260.86,340.14 260.86,367.38 ; C23.1 279.66,151.3 279.87,151.51 ; 279.89,205.74 285.37,205.74 286.89,204.22 286.89,197.73 286.26,197.1 R12.1 ; 279.89,205.74 279.7,205.55 C21.1 ; 279.53,260.35 260.9,260.35 260.86,260.39 ; 279.53,260.35 279.75,260.13 C19.1 ; 279.53,260.35 285.5,260.35 287.15,258.7 287.15,252.22 286,251.07 R4.1 ; 279.58,313.44 285.88,313.44 287.27,312.04 287.27,306.32 286.12,305.17 R52.1 ; 279.58,313.44 279.7,313.31 C31.1 ; 279.58,313.44 261.07,313.44 260.86,313.22 ; 279.78,124.46 279.75,124.43 C24.1 ; 279.78,124.46 285.75,124.46 286.64,123.57 286.64,116.84 285.81,116.02 R24.1 ; 260.86,367.38 260.86,395.1 ; 260.86,395.1 261.11,395.35 280.02,395.35 ; 279.87,151.51 285.75,151.51 286.64,150.62 286.64,143.89 285.88,143.13 R20.1 ; 279.64,178.69 285.75,178.69 286.77,177.67 286.77,170.94 286,170.18 R32.1 ; 279.64,178.69 279.7,178.63 C26.1 ; 260.86,313.22 260.86,287.65 ; 279.57,287.4 279.72,287.25 C20.1 ; 279.57,287.4 261.11,287.4 260.86,287.65 ; 279.47,340.11 279.72,339.85 C30.1 ; 279.47,340.11 286,340.11 287.27,338.84 287.27,333.12 286.26,332.1 R48.1 ; 260.86,260.39 260.86,287.65 ; 279.6,69.47 279.75,69.32 C29.1 ; 280.02,395.35 286,395.35 287.15,394.21 287.15,386.84 286.38,386.08 R56.1 ; R40.1 282.88,35.05 285.5,35.05 286.13,35.69 286.13,41.02 285.12,42.04 279.96,42.04
  Top Layer w1: U24.3 272.39,412.66 C34.2
LDO_5V_SWITCH: length 447.6
  Top Layer w0.3: U2.14 22.64,323.48 C4.2 ; C10.2 22.64,203.44 U5.14 ; U9.14 22.64,43.41 C18.2 ; C16.2 22.64,83.54 U8.14 ; C14.2 22.64,123.51 U7.14 ; C12.2 22.64,163.46 U6.14 ; C5.2 22.14,284.8 U3.13 ; C8.2 22.64,243.55 U4.14 ; C15.2 22.14,84.7 U8.13 ; U3.14 22.64,283.5 C6.2 ; U2.13 22.14,324.78 C3.2 ; U4.13 22.14,244.84 C7.2 ; U7.13 22.14,124.82 C13.2 ; U1.14 22.64,363.45 C2.2 ; C17.2 22.14,44.69 U9.13 ; C1.2 22.14,364.76 U1.13 ; 20.51,163.13 22.14,164.76 U6.13 ; C9.2 22.14,204.71 U5.13
  Top Layer w0.8: U25.3 22.35,412.24 20.38,412.24 20.38,412.56 19.05,413.89 18.92,413.77 17.53,413.77 7.49,403.73 7.49,53.59 17.91,43.18 22.29,43.18 C18.2 ; C2.2 22.33,363.18 C1.2
MCO_A: length 4.2
  Top Layer w0.54: U23.6 279.54,387.35 R53.1 280.81,386.08 R56.2
MCO_B: length 3.7
  Top Layer w0.54: U23.7 279.77,388.62 R53.2 281.31,388.61 R55.1
MCU_VDD: length 474.2
  Top Layer w0.3: U1.43 24.64,377.57 25.4,378.33
  Top Layer w0.83: 25.4,378.33 34.8,387.73 34.8,411.61 40.89,417.7 312.42,417.7 326.26,403.86 326.26,270.95 P33.10
RSTN_A: length 4.1
  Top Layer w0.54: R48.2 280.67,332.1 R45.1 279.4,333.38 U21.6
RSTN_B: length 3.6
  Top Layer w0.54: R47.1 281.19,334.57 R45.2 279.63,334.64 U21.7
TCLK_A: length 4
  Top Layer w0.54: R36.2 280.49,359.22 R33.1 279.28,360.43 U18.6
TCLK_B: length 3.6
  Top Layer w0.54: U18.7 279.52,361.7 R33.2 279.61,361.77 R35.1
TDI_A: length 4
  Top Layer w0.54: U20.6 279.29,63.37 R41.1 280.57,62.09 R44.2
TDI_B: length 3.6
  Top Layer w0.54: U20.7 279.53,64.64 R41.2 281.01,64.56 R43.1
TDO_A: length 4.1
  Top Layer w0.54: 281.22,305.17 280.78,305.17 R49.1 279.5,306.45 U22.6
TDO_B: length 3.6
  Top Layer w0.54: U22.7 279.64,307.72 R49.2 281.15,307.77 281.22,307.84
TSTROBE_A: length 4.2
  Top Layer w0.54: U19.6 279.41,36.45 279.77,36.08 280.74,35.12 R40.2
TSTROBE_B: length 3.7
  Top Layer w0.54: R39.1 281.25,37.59 R37.2 279.65,37.72 U19.7
WR_A: length 4.1
  Top Layer w0.54: U16.6 279.35,90.42 R25.1 280.68,89.09 R28.2
WR_B: length 3.6
  Top Layer w0.54: R27.1 281.18,91.57 R25.2 279.58,91.69 U16.7
$3N4213: length 3.2
  Top Layer w0.54: R2.1 270.42,252.35 U10.3 U10.2
$3N4223: length 3.2
  Top Layer w0.54: U11.2 U11.3 270.42,279.4 270.34,279.32
$3N4233: length 3.2
  Top Layer w0.54: R10.1 270.52,198.37 U12.3 U12.2
$3N4243: length 3.2
  Top Layer w0.54: R14.1 270.52,225.42 272.25,225.42 U13.2
$3N4253: length 3.2
  Top Layer w0.54: U14.2 272.25,144.4 270.52,144.4 R18.1
$3N4263: length 3.2
  Top Layer w0.54: U15.2 U15.3 270.35,117.35 R22.1
$3N4273: length 3.2
  Top Layer w0.54: R26.1 270.47,90.42 U16.3 U16.2
$3N4283: length 3.3
  Top Layer w0.54: U17.2 U17.3 270.45,171.45 R30.1
$3N4293: length 3.3
  Top Layer w0.54: U18.2 U18.3 270.42,360.43 R34.1
$3N4303: length 3.2
  Top Layer w0.54: R38.1 270.52,36.45 U19.3 U19.2
$3N4313: length 3.2
  Top Layer w0.54: U20.2 U20.3 270.43,63.37 R42.1
$3N4323: length 3.2
  Top Layer w0.54: R46.1 270.41,333.38 U21.3 U21.2
$3N4333: length 3.2
  Top Layer w0.54: R50.1 270.52,307.72 U22.2 U22.3
$3N4343: length 3.3
  Top Layer w0.54: R54.1 270.35,388.62 U23.2 U23.3
